# EAGLE design lajta-hfcs (EAGLE 6.4)

## Sheet 1 of 3
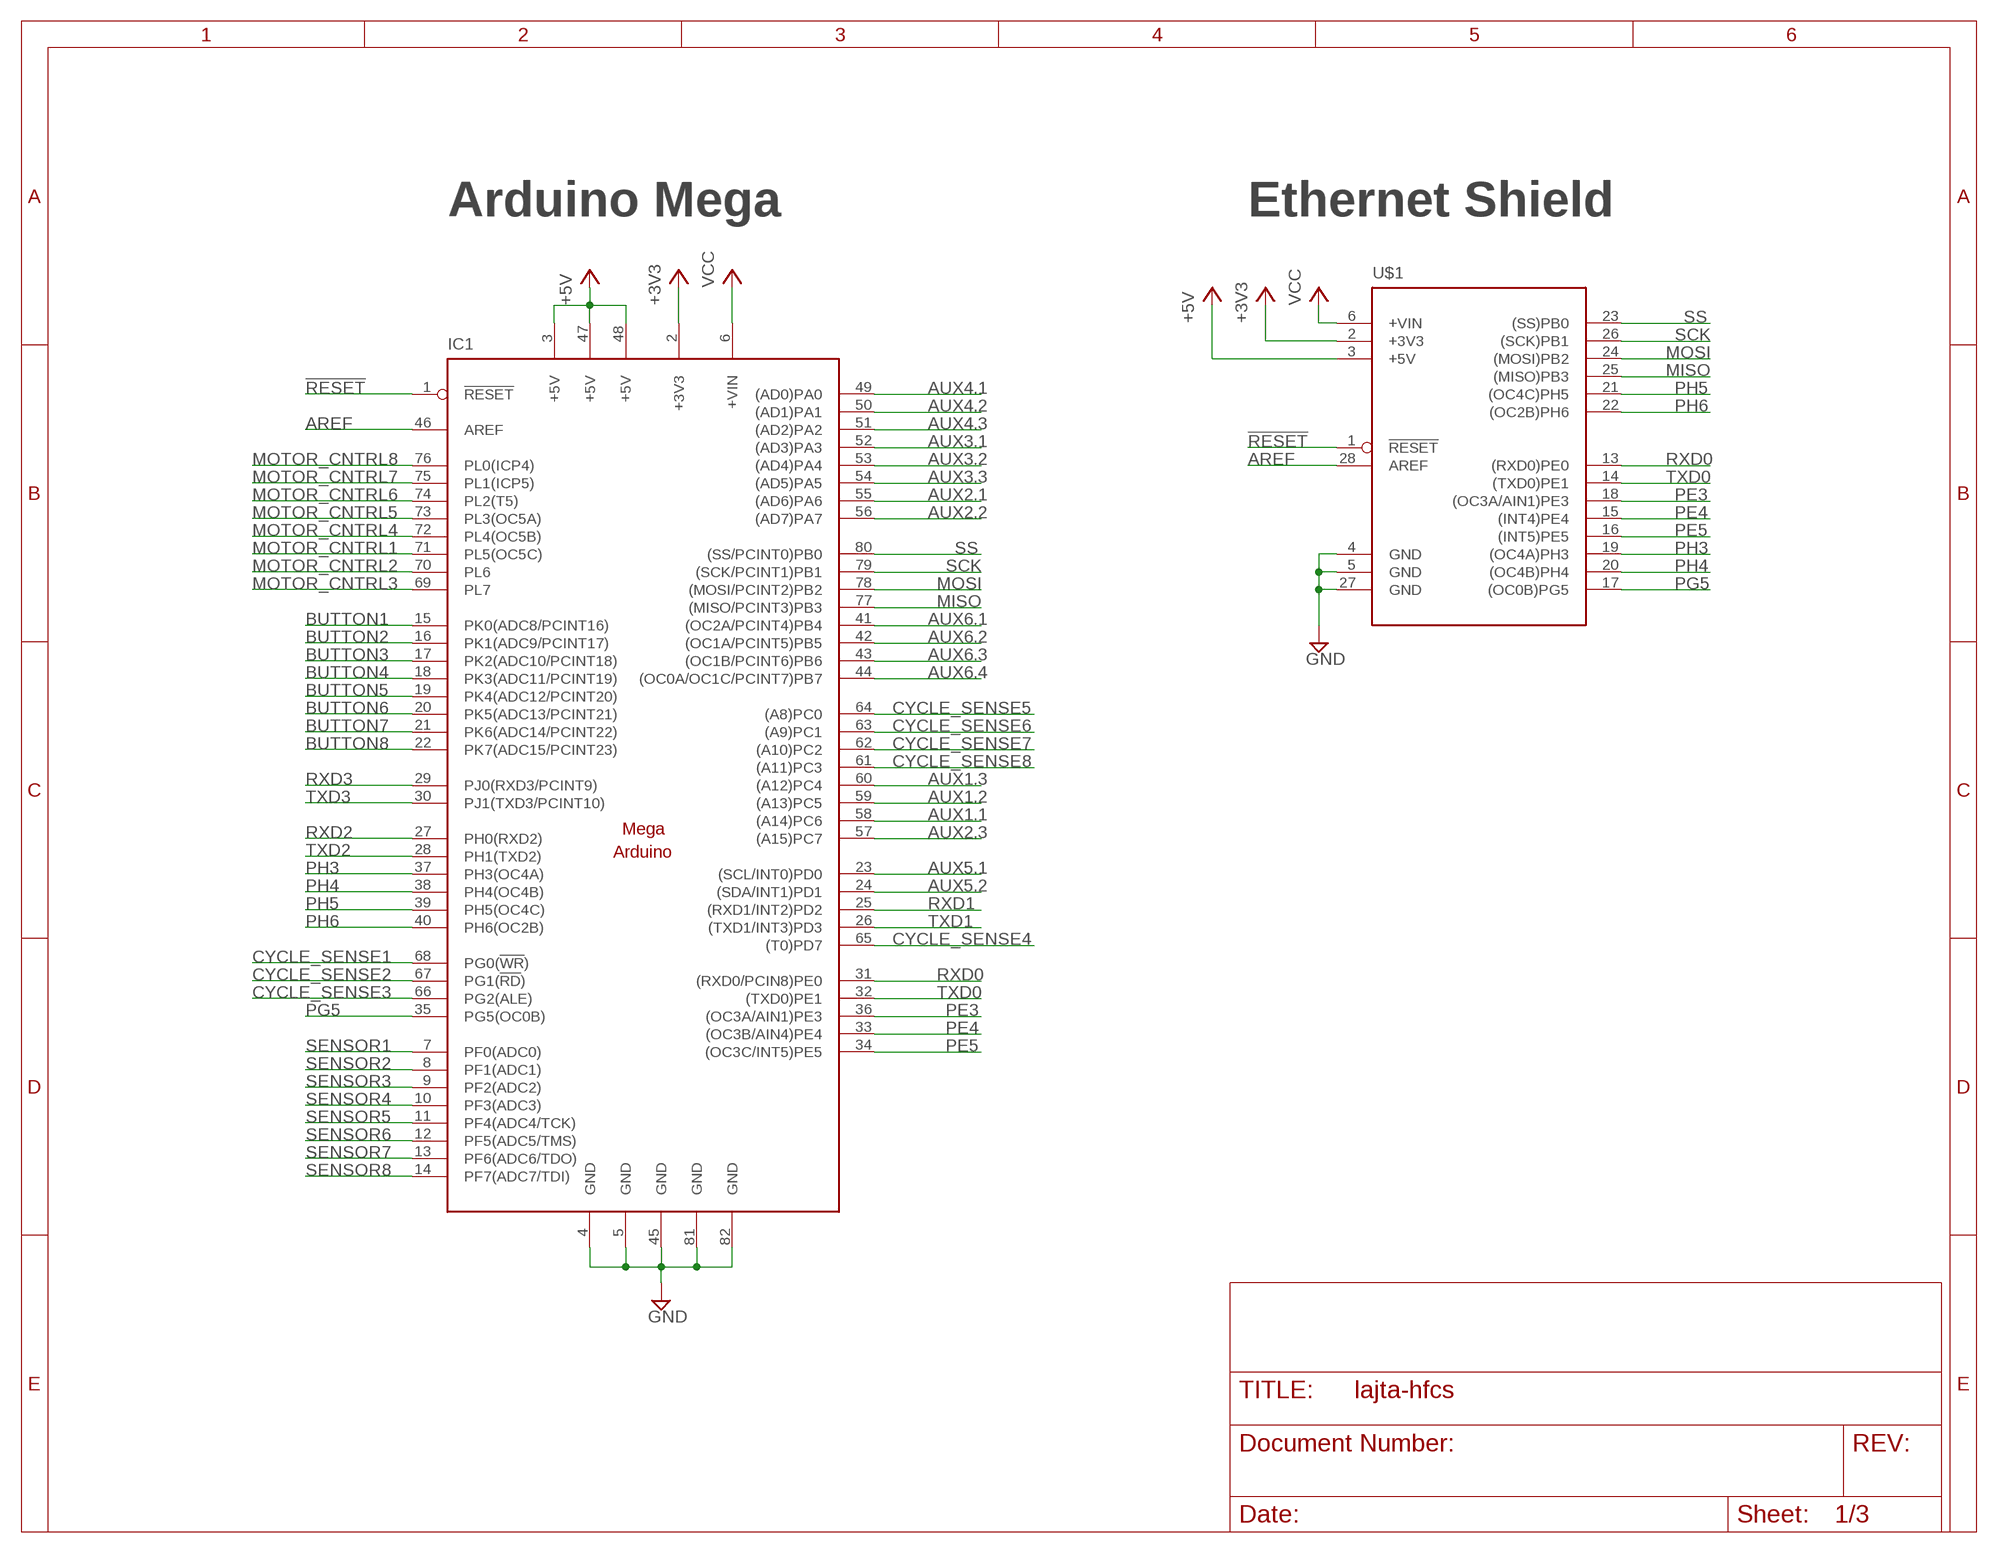
[diagram p0: schematic, sheet 1]

### Parts
IC1  MEGAARDUINO_1  [MEGA_ARDUINO]
U$1  MEGAARDUINO_ETHERNET_SHIELD  [ETHERNET_SHIELD]

### Nets
!RESET: IC1.1(!RESET) U$1.1(!RESET)
+3V3: IC1.2(+3V3) U$1.2(+3V3)
+5V: IC1.3(+5V) IC1.47(+5V) IC1.48(+5V) U$1.3(+5V) ; also sheet 2,3
AREF: IC1.46(AREF) U$1.28(AREF)
AUX1.1: IC1.58((A14)PC6) ; also sheet 3
AUX1.2: IC1.59((A13)PC5) ; also sheet 3
AUX1.3: IC1.60((A12)PC4) ; also sheet 3
AUX2.1: IC1.55((AD6)PA6) ; also sheet 3
AUX2.2: IC1.56((AD7)PA7) ; also sheet 3
AUX2.3: IC1.57((A15)PC7) ; also sheet 3
AUX3.1: IC1.52((AD3)PA3) ; also sheet 3
AUX3.2: IC1.53((AD4)PA4) ; also sheet 3
AUX3.3: IC1.54((AD5)PA5) ; also sheet 3
AUX4.1: IC1.49((AD0)PA0) ; also sheet 3
AUX4.2: IC1.50((AD1)PA1) ; also sheet 3
AUX4.3: IC1.51((AD2)PA2) ; also sheet 3
AUX5.1: IC1.23((SCL/INT0)PD0) ; also sheet 3
AUX5.2: IC1.24((SDA/INT1)PD1) ; also sheet 3
AUX6.1: IC1.41((OC2A/PCINT4)PB4) ; also sheet 3
AUX6.2: IC1.42((OC1A/PCINT5)PB5) ; also sheet 3
AUX6.3: IC1.43((OC1B/PCINT6)PB6) ; also sheet 3
AUX6.4: IC1.44((OC0A/OC1C/PCINT7)PB7) ; also sheet 3
BUTTON1: IC1.15(PK0(ADC8/PCINT16)) ; also sheet 3
BUTTON2: IC1.16(PK1(ADC9/PCINT17)) ; also sheet 3
BUTTON3: IC1.17(PK2(ADC10/PCINT18)) ; also sheet 3
BUTTON4: IC1.18(PK3(ADC11/PCINT19)) ; also sheet 3
BUTTON5: IC1.19(PK4(ADC12/PCINT20)) ; also sheet 3
BUTTON6: IC1.20(PK5(ADC13/PCINT21)) ; also sheet 3
BUTTON7: IC1.21(PK6(ADC14/PCINT22)) ; also sheet 3
BUTTON8: IC1.22(PK7(ADC15/PCINT23)) ; also sheet 3
CYCLE_SENSE1: IC1.68(PG0(!WR!)) ; also sheet 3
CYCLE_SENSE2: IC1.67(PG1(!RD!)) ; also sheet 3
CYCLE_SENSE3: IC1.66(PG2(ALE)) ; also sheet 3
CYCLE_SENSE4: IC1.65((T0)PD7) ; also sheet 3
CYCLE_SENSE5: IC1.64((A8)PC0) ; also sheet 3
CYCLE_SENSE6: IC1.63((A9)PC1) ; also sheet 3
CYCLE_SENSE7: IC1.62((A10)PC2) ; also sheet 3
CYCLE_SENSE8: IC1.61((A11)PC3) ; also sheet 3
GND: IC1.4(GND) IC1.5(GND) IC1.45(GND) IC1.81(GND) IC1.82(GND) U$1.4(GND) U$1.5(GND) U$1.27(GND) ; also sheet 2,3
MISO: IC1.77((MISO/PCINT3)PB3) U$1.25((MISO)PB3) ; also sheet 3
MOSI: IC1.78((MOSI/PCINT2)PB2) U$1.24((MOSI)PB2) ; also sheet 3
MOTOR_CNTRL1: IC1.71(PL5(OC5C)) ; also sheet 2
MOTOR_CNTRL2: IC1.70(PL6) ; also sheet 2
MOTOR_CNTRL3: IC1.69(PL7) ; also sheet 2
MOTOR_CNTRL4: IC1.72(PL4(OC5B)) ; also sheet 2
MOTOR_CNTRL5: IC1.73(PL3(OC5A)) ; also sheet 2
MOTOR_CNTRL6: IC1.74(PL2(T5)) ; also sheet 2
MOTOR_CNTRL7: IC1.75(PL1(ICP5)) ; also sheet 2
MOTOR_CNTRL8: IC1.76(PL0(ICP4)) ; also sheet 2
PE3: IC1.36((OC3A/AIN1)PE3) U$1.18((OC3A/AIN1)PE3)
PE4: IC1.33((OC3B/AIN4)PE4) U$1.15((INT4)PE4)
PE5: IC1.34((OC3C/INT5)PE5) U$1.16((INT5)PE5)
PG5: IC1.35(PG5(OC0B)) U$1.17((OC0B)PG5)
PH3: IC1.37(PH3(OC4A)) U$1.19((OC4A)PH3)
PH4: IC1.38(PH4(OC4B)) U$1.20((OC4B)PH4)
PH5: IC1.39(PH5(OC4C)) U$1.21((OC4C)PH5)
PH6: IC1.40(PH6(OC2B)) U$1.22((OC2B)PH6)
RXD0: IC1.31((RXD0/PCIN8)PE0) U$1.13((RXD0)PE0)
RXD1: IC1.25((RXD1/INT2)PD2) ; also sheet 3
RXD2: IC1.27(PH0(RXD2)) ; also sheet 3
RXD3: IC1.29(PJ0(RXD3/PCINT9)) ; also sheet 3
SCK: IC1.79((SCK/PCINT1)PB1) U$1.26((SCK)PB1) ; also sheet 3
SENSOR1: IC1.7(PF0(ADC0)) ; also sheet 3
SENSOR2: IC1.8(PF1(ADC1)) ; also sheet 3
SENSOR3: IC1.9(PF2(ADC2)) ; also sheet 3
SENSOR4: IC1.10(PF3(ADC3)) ; also sheet 3
SENSOR5: IC1.11(PF4(ADC4/TCK)) ; also sheet 3
SENSOR6: IC1.12(PF5(ADC5/TMS)) ; also sheet 3
SENSOR7: IC1.13(PF6(ADC6/TDO)) ; also sheet 3
SENSOR8: IC1.14(PF7(ADC7/TDI)) ; also sheet 3
SS: IC1.80((SS/PCINT0)PB0) U$1.23((SS)PB0) ; also sheet 3
TXD0: IC1.32((TXD0)PE1) U$1.14((TXD0)PE1)
TXD1: IC1.26((TXD1/INT3)PD3) ; also sheet 3
TXD2: IC1.28(PH1(TXD2)) ; also sheet 3
TXD3: IC1.30(PJ1(TXD3/PCINT10)) ; also sheet 3
VCC: IC1.6(+VIN) U$1.6(+VIN)

### Notes on the sheet
- Arduino Mega | Ethernet Shield

## Sheet 2 of 3
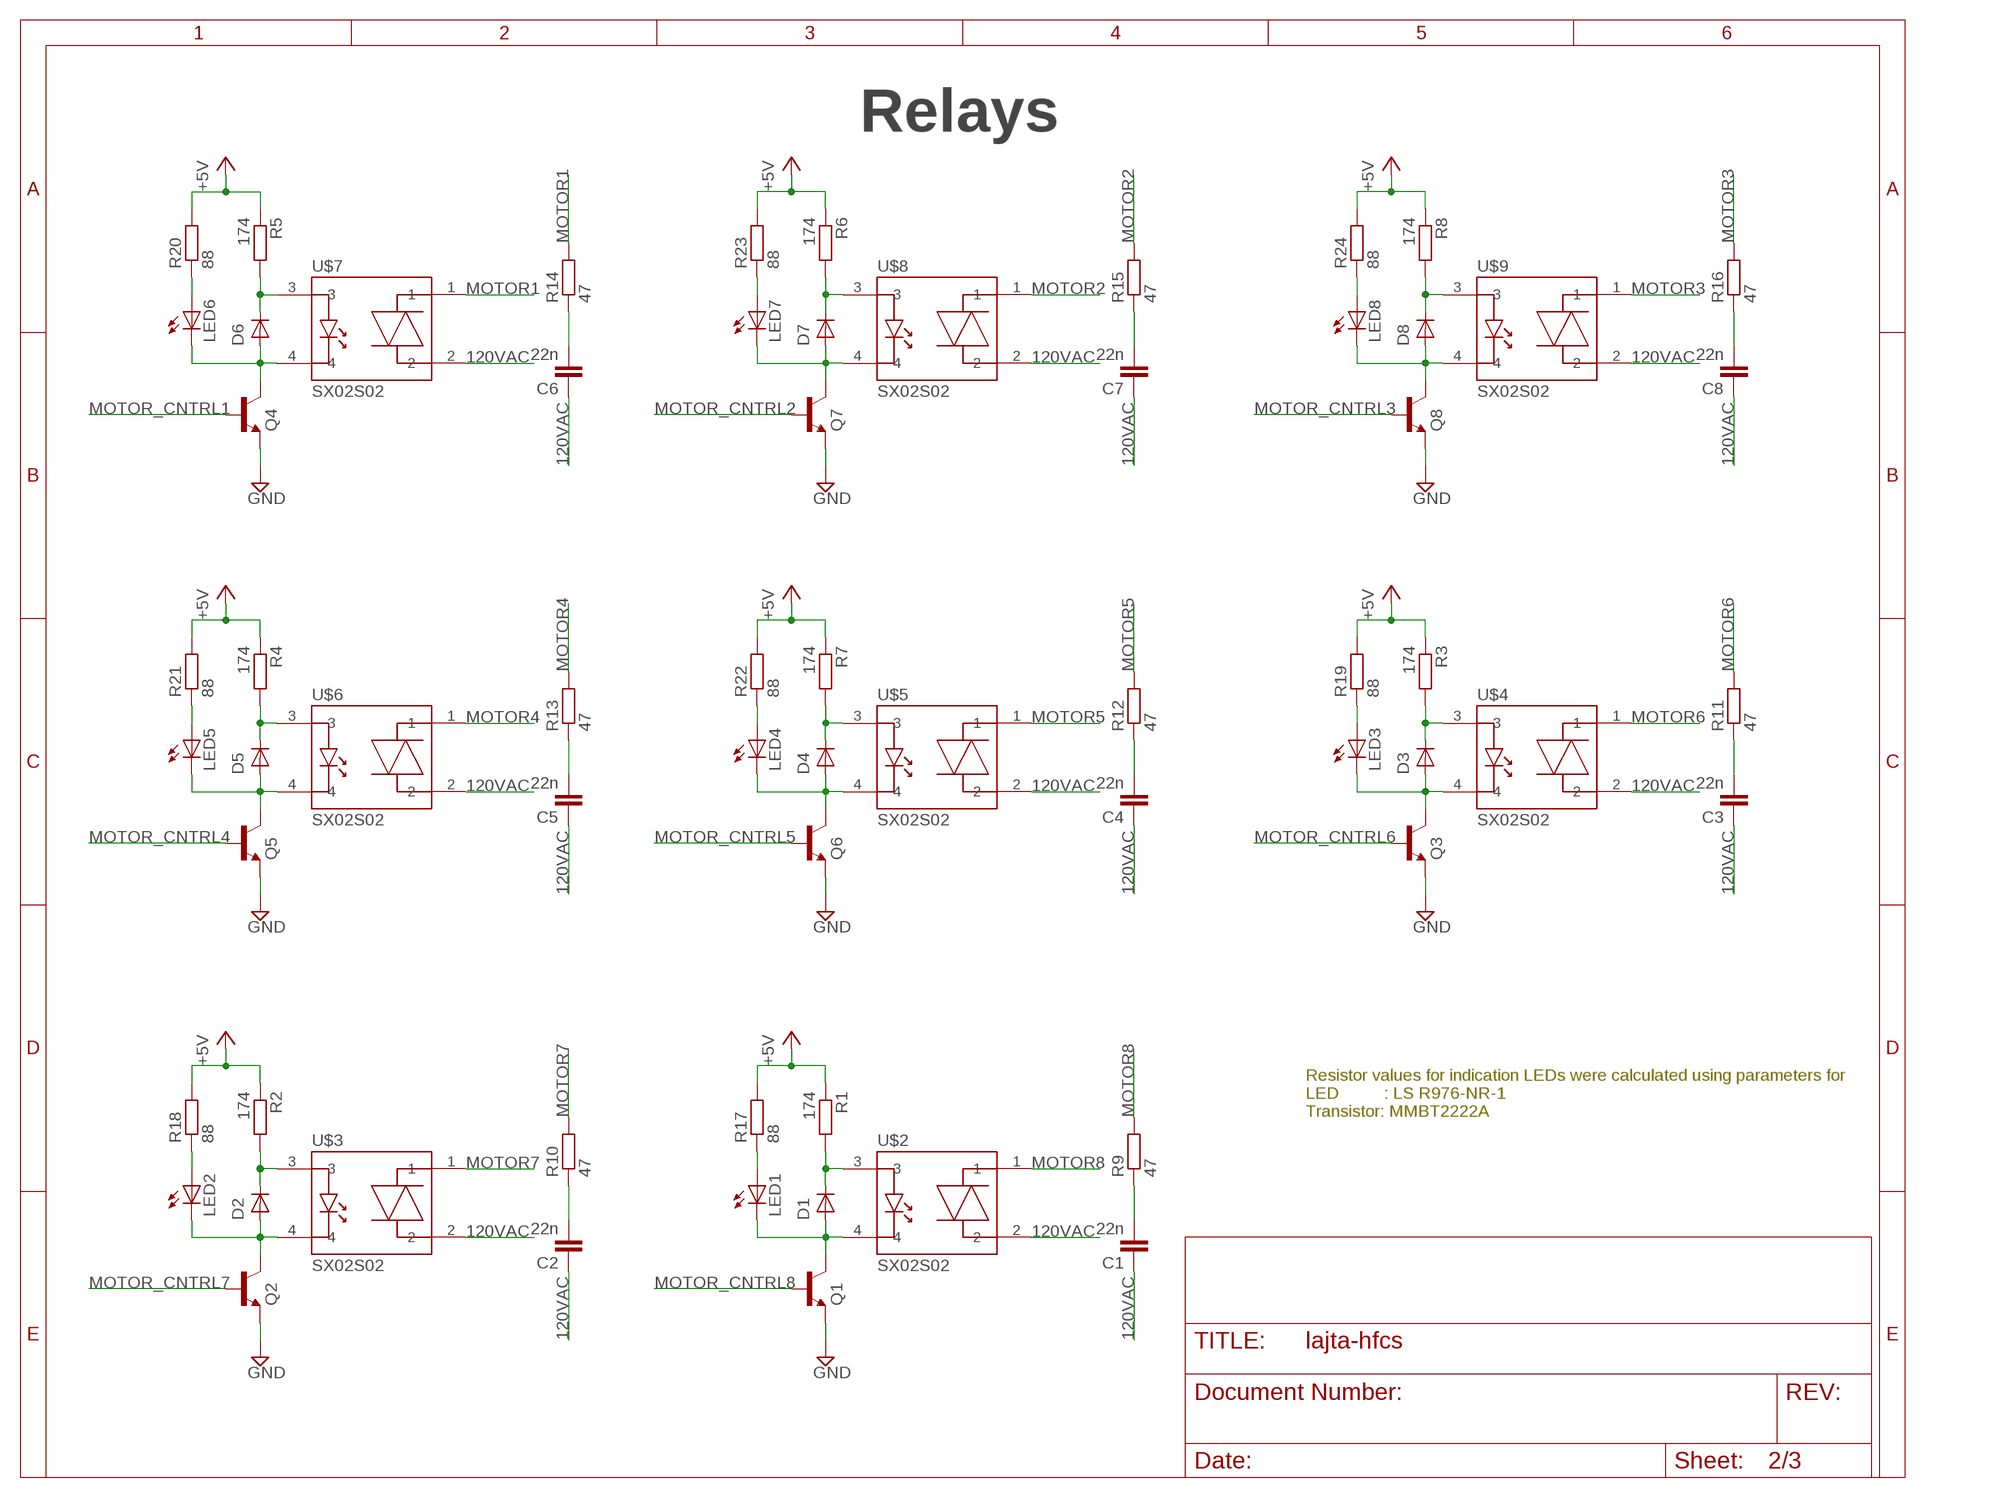
[diagram p1: schematic, sheet 2]

### Parts
C1  22n  C-EUC1812  [C1812]
C2  22n  C-EUC1812  [C1812]
C3  22n  C-EUC1812  [C1812]
C4  22n  C-EUC1812  [C1812]
C5  22n  C-EUC1812  [C1812]
C6  22n  C-EUC1812  [C1812]
C7  22n  C-EUC1812  [C1812]
C8  22n  C-EUC1812  [C1812]
D1  1N4448W  [SOD123]
D2  1N4448W  [SOD123]
D3  1N4448W  [SOD123]
D4  1N4448W  [SOD123]
D5  1N4448W  [SOD123]
D6  1N4448W  [SOD123]
D7  1N4448W  [SOD123]
D8  1N4448W  [SOD123]
LED1  LEDCHIPLED_0805  [CHIPLED_0805]
LED2  LEDCHIPLED_0805  [CHIPLED_0805]
LED3  LEDCHIPLED_0805  [CHIPLED_0805]
LED4  LEDCHIPLED_0805  [CHIPLED_0805]
LED5  LEDCHIPLED_0805  [CHIPLED_0805]
LED6  LEDCHIPLED_0805  [CHIPLED_0805]
LED7  LEDCHIPLED_0805  [CHIPLED_0805]
LED8  LEDCHIPLED_0805  [CHIPLED_0805]
Q1  MMBT2222A  [SOT23]
Q2  MMBT2222A  [SOT23]
Q3  MMBT2222A  [SOT23]
Q4  MMBT2222A  [SOT23]
Q5  MMBT2222A  [SOT23]
Q6  MMBT2222A  [SOT23]
Q7  MMBT2222A  [SOT23]
Q8  MMBT2222A  [SOT23]
R1  174  R-EU_R0805  [R0805]
R2  174  R-EU_R0805  [R0805]
R3  174  R-EU_R0805  [R0805]
R4  174  R-EU_R0805  [R0805]
R5  174  R-EU_R0805  [R0805]
R6  174  R-EU_R0805  [R0805]
R7  174  R-EU_R0805  [R0805]
R8  174  R-EU_R0805  [R0805]
R9  47  R-EU_R0805  [R0805]
R10  47  R-EU_R0805  [R0805]
R11  47  R-EU_R0805  [R0805]
R12  47  R-EU_R0805  [R0805]
R13  47  R-EU_R0805  [R0805]
R14  47  R-EU_R0805  [R0805]
R15  47  R-EU_R0805  [R0805]
R16  47  R-EU_R0805  [R0805]
R17  88  R-EU_R0805  [R0805]
R18  88  R-EU_R0805  [R0805]
R19  88  R-EU_R0805  [R0805]
R20  88  R-EU_R0805  [R0805]
R21  88  R-EU_R0805  [R0805]
R22  88  R-EU_R0805  [R0805]
R23  88  R-EU_R0805  [R0805]
R24  88  R-EU_R0805  [R0805]
U$2  SX02S02  [SIP-4]
U$3  SX02S02  [SIP-4]
U$4  SX02S02  [SIP-4]
U$5  SX02S02  [SIP-4]
U$6  SX02S02  [SIP-4]
U$7  SX02S02  [SIP-4]
U$8  SX02S02  [SIP-4]
U$9  SX02S02  [SIP-4]

### Nets
120VAC: C1.1 C2.1 C3.1 C4.1 C5.1 C6.1 C7.1 C8.1 U$2.2 U$3.2 U$4.2 U$5.2 U$6.2 U$7.2 U$8.2 U$9.2 ; also sheet 3
+5V: R1.1 R2.1 R3.1 R4.1 R5.1 R6.1 R7.1 R8.1 R17.2 R18.2 R19.2 R20.2 R21.2 R22.2 R23.2 R24.2 ; also sheet 1,3
GND: Q1.2(E) Q2.2(E) Q3.2(E) Q4.2(E) Q5.2(E) Q6.2(E) Q7.2(E) Q8.2(E) ; also sheet 1,3
MOTOR1: R14.2 U$7.1 ; also sheet 3
MOTOR2: R15.2 U$8.1 ; also sheet 3
MOTOR3: R16.2 U$9.1 ; also sheet 3
MOTOR4: R13.2 U$6.1 ; also sheet 3
MOTOR5: R12.2 U$5.1 ; also sheet 3
MOTOR6: R11.2 U$4.1 ; also sheet 3
MOTOR7: R10.2 U$3.1 ; also sheet 3
MOTOR8: R9.2 U$2.1 ; also sheet 3
MOTOR_CNTRL1: Q4.1(B) ; also sheet 1
MOTOR_CNTRL2: Q7.1(B) ; also sheet 1
MOTOR_CNTRL3: Q8.1(B) ; also sheet 1
MOTOR_CNTRL4: Q5.1(B) ; also sheet 1
MOTOR_CNTRL5: Q6.1(B) ; also sheet 1
MOTOR_CNTRL6: Q3.1(B) ; also sheet 1
MOTOR_CNTRL7: Q2.1(B) ; also sheet 1
MOTOR_CNTRL8: Q1.1(B) ; also sheet 1
N$1: D1.C R1.2 U$2.3
N$2: D1.A LED1.C Q1.3(C) U$2.4
N$3: LED1.A R17.1
N$4: D2.C R2.2 U$3.3
N$5: D2.A LED2.C Q2.3(C) U$3.4
N$6: LED2.A R18.1
N$7: D3.C R3.2 U$4.3
N$8: D3.A LED3.C Q3.3(C) U$4.4
N$9: LED3.A R19.1
N$10: D4.C R7.2 U$5.3
N$11: D4.A LED4.C Q6.3(C) U$5.4
N$12: LED4.A R22.1
N$13: D5.C R4.2 U$6.3
N$14: D5.A LED5.C Q5.3(C) U$6.4
N$15: LED5.A R21.1
N$16: LED6.A R20.1
N$17: D6.A LED6.C Q4.3(C) U$7.4
N$18: D6.C R5.2 U$7.3
N$19: LED7.A R23.1
N$20: D7.A LED7.C Q7.3(C) U$8.4
N$21: D7.C R6.2 U$8.3
N$22: LED8.A R24.1
N$23: D8.A LED8.C Q8.3(C) U$9.4
N$24: D8.C R8.2 U$9.3
N$33: C8.2 R16.1
N$34: C7.2 R15.1
N$35: C4.2 R12.1
N$36: C5.2 R13.1
N$37: C6.2 R14.1
N$38: C3.2 R11.1
N$39: C2.2 R10.1
N$40: C1.2 R9.1

### Notes on the sheet
- Relays
- Resistor values for indication LEDs were calculated using parameters for
  LED          : LS R976-NR-1
  Transistor: MMBT2222A

## Sheet 3 of 3
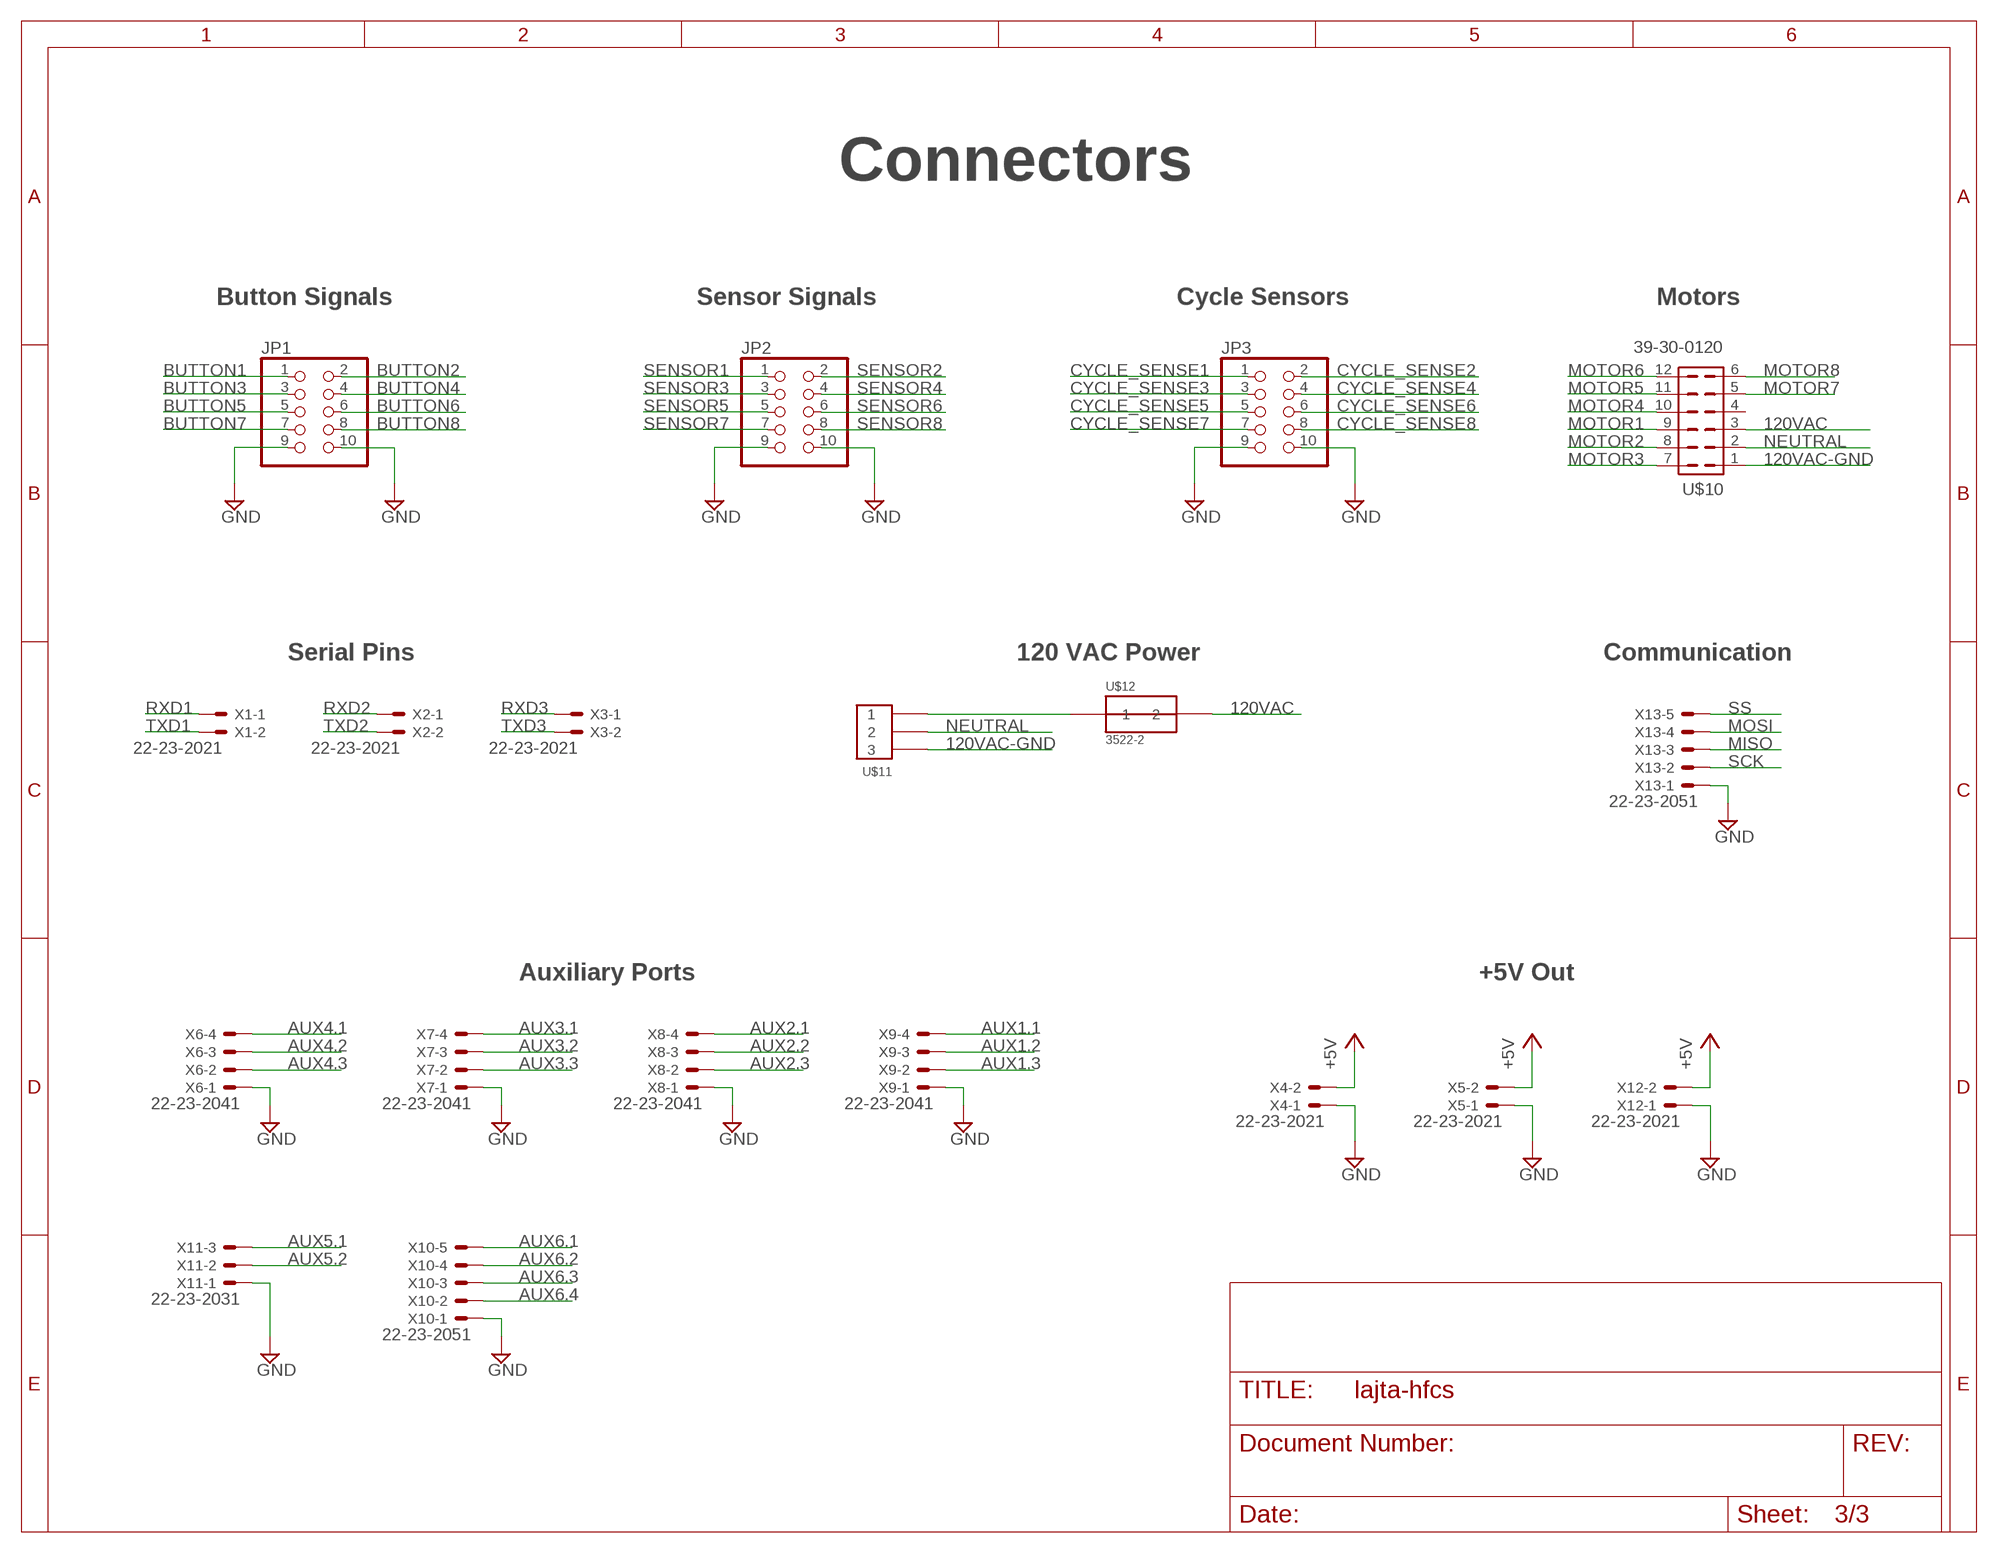
[diagram p2: schematic, sheet 3]

### Parts
JP1  PINHD-2X05_2.00  [2X05M]
JP2  PINHD-2X05_2.00  [2X05M]
JP3  PINHD-2X05_2.00  [2X05M]
U$10  39-30-0120  [MINIFIT5569-2-6]
U$11  39-30-3035  [39-30-3035]
U$12  3522-2  [ATC]
X1  22-23-2021  [22-23-2021]
X2  22-23-2021  [22-23-2021]
X3  22-23-2021  [22-23-2021]
X4  22-23-2021  [22-23-2021]
X5  22-23-2021  [22-23-2021]
X6  22-23-2041  [22-23-2041]
X7  22-23-2041  [22-23-2041]
X8  22-23-2041  [22-23-2041]
X9  22-23-2041  [22-23-2041]
X10  22-23-2051  [22-23-2051]
X11  22-23-2031  [22-23-2031]
X12  22-23-2021  [22-23-2021]
X13  22-23-2051  [22-23-2051]

### Nets
120VAC: U$10.3 U$12.4 ; also sheet 2
120VAC-GND: U$10.1 U$11.3
+5V: X4.2 X5.2 X12.2 ; also sheet 1,2
AUX1.1: X9.4 ; also sheet 1
AUX1.2: X9.3 ; also sheet 1
AUX1.3: X9.2 ; also sheet 1
AUX2.1: X8.4 ; also sheet 1
AUX2.2: X8.3 ; also sheet 1
AUX2.3: X8.2 ; also sheet 1
AUX3.1: X7.4 ; also sheet 1
AUX3.2: X7.3 ; also sheet 1
AUX3.3: X7.2 ; also sheet 1
AUX4.1: X6.4 ; also sheet 1
AUX4.2: X6.3 ; also sheet 1
AUX4.3: X6.2 ; also sheet 1
AUX5.1: X11.3 ; also sheet 1
AUX5.2: X11.2 ; also sheet 1
AUX6.1: X10.5 ; also sheet 1
AUX6.2: X10.4 ; also sheet 1
AUX6.3: X10.3 ; also sheet 1
AUX6.4: X10.2 ; also sheet 1
BUTTON1: JP1.1 ; also sheet 1
BUTTON2: JP1.2 ; also sheet 1
BUTTON3: JP1.3 ; also sheet 1
BUTTON4: JP1.4 ; also sheet 1
BUTTON5: JP1.5 ; also sheet 1
BUTTON6: JP1.6 ; also sheet 1
BUTTON7: JP1.7 ; also sheet 1
BUTTON8: JP1.8 ; also sheet 1
CYCLE_SENSE1: JP3.1 ; also sheet 1
CYCLE_SENSE2: JP3.2 ; also sheet 1
CYCLE_SENSE3: JP3.3 ; also sheet 1
CYCLE_SENSE4: JP3.4 ; also sheet 1
CYCLE_SENSE5: JP3.5 ; also sheet 1
CYCLE_SENSE6: JP3.6 ; also sheet 1
CYCLE_SENSE7: JP3.7 ; also sheet 1
CYCLE_SENSE8: JP3.8 ; also sheet 1
GND: JP1.9 JP1.10 JP2.9 JP2.10 JP3.9 JP3.10 X4.1 X5.1 X6.1 X7.1 X8.1 X9.1 X10.1 X11.1 X12.1 X13.1 ; also sheet 1,2
MISO: X13.3 ; also sheet 1
MOSI: X13.4 ; also sheet 1
MOTOR1: U$10.9 ; also sheet 2
MOTOR2: U$10.8 ; also sheet 2
MOTOR3: U$10.7 ; also sheet 2
MOTOR4: U$10.10 ; also sheet 2
MOTOR5: U$10.11 ; also sheet 2
MOTOR6: U$10.12 ; also sheet 2
MOTOR7: U$10.5 ; also sheet 2
MOTOR8: U$10.6 ; also sheet 2
N$25: U$11.1 U$12.1
NEUTRAL: U$10.2 U$11.2
RXD1: X1.1 ; also sheet 1
RXD2: X2.1 ; also sheet 1
RXD3: X3.1 ; also sheet 1
SCK: X13.2 ; also sheet 1
SENSOR1: JP2.1 ; also sheet 1
SENSOR2: JP2.2 ; also sheet 1
SENSOR3: JP2.3 ; also sheet 1
SENSOR4: JP2.4 ; also sheet 1
SENSOR5: JP2.5 ; also sheet 1
SENSOR6: JP2.6 ; also sheet 1
SENSOR7: JP2.7 ; also sheet 1
SENSOR8: JP2.8 ; also sheet 1
SS: X13.5 ; also sheet 1
TXD1: X1.2 ; also sheet 1
TXD2: X2.2 ; also sheet 1
TXD3: X3.2 ; also sheet 1
Unconnected: U$10.4

### Notes on the sheet
- Connectors
- Button Signals | Sensor Signals | Cycle Sensors | Motors
- Serial Pins | 120 VAC Power | Communication
- Auxiliary Ports | +5V Out

## Library data of the parts
C1-C8 = rcl:C-EU: CAPACITOR, European symbol
D1-D8 = diodes-standard:1N4448W
IC1 = arduino:MEGAARDUINO_1: The Arduino Mega is a microcontroller board based on the ATmega1280. - 54 digital input/output pins (of which 14 can be used as PWM outputs) - 16 analog inputs - 4 UARTs (hardware serial ports) - 16 MHz crystal oscillator - USB connection - power jack - ICSP header - reset button It contains everything needed to support the microcontroller; simply connect it to a computer with a USB cable or power it with a AC-to-DC adapter or battery to get started. The Mega is compatible with most shields designed for the Arduino Duemilanove or Diecimila. http://arduino.cc/en/Main/ArduinoBoardMega
JP1-JP3 = pinhead-2:PINHD-2X05: PIN HEADER
LED1-LED8 = led:LED: LED OSRAM: - CHIPLED LG R971, LG N971, LY N971, LG Q971, LY Q971, LO R971, LY R971 LH N974, LH R974 LS Q976, LO Q976, LY Q976 LO Q996 - Hyper CHIPLED LW Q18S LB Q993, LB Q99A, LB R99A - SideLED LS A670, LO A670, LY A670, LG A670, LP A670 LB A673, LV A673, LT A673, LW A673 LH A674 LY A675 LS A676, LA A676, LO A676, LY A676, LW A676 LS A679, LY A679, LG A679 - Hyper Micro SIDELED® LS Y876, LA Y876, LO Y876, LY Y876 LT Y87S - SmartLED LW L88C, LW L88S LB L89C, LB L89S, LG L890 LS L89K, LO L89K, LY L89K LS L896, LA L896, LO L896, LY L896 - TOPLED LS T670, LO T670, LY T670, LG T670, LP T670 LSG T670, LSP T670, LSY T670, LOP T670, LYG T670 LG T671, LOG T671, LSG T671 LB T673, LV T673, LT T673, LW T673 LH T674 LS T676, LA T676, LO T676, LY T676, LB T676, LH T676, LSB T676, LW T676 LB T67C, LV T67C, LT T67C, LS T67K, LO T67K, LY T67K, LW E67C LS E67B, LA E67B, LO E67B, LY E67B, LB E67C, LV E67C, LT E67C LW T67C LS T679, LY T679, LG T679 LS T770, LO T770, LY T770, LG T770, LP T770 LB T773, LV T773, LT T773, LW T773 LH T774 LS E675, LA E675, LY E675, LS T675 LS T776, LA T776, LO T776, LY T776, LB T776 LHGB T686 LT T68C, LB T68C - Hyper Mini TOPLED® LB M676 - Mini TOPLED Santana® LG M470 LS M47K, LO M47K, LY M47K Source: http://www.osram.convergy.de LUXEON: - LUMILED® LXK2-PW12-R00, LXK2-PW12-S00, LXK2-PW14-U00, LXK2-PW14-V00 LXK2-PM12-R00, LXK2-PM12-S00, LXK2-PM14-U00 LXK2-PE12-Q00, LXK2-PE12-R00, LXK2-PE12-S00, LXK2-PE14-T00, LXK2-PE14-U00 LXK2-PB12-K00, LXK2-PB12-L00, LXK2-PB12-M00, LXK2-PB14-N00, LXK2-PB14-P00, LXK2-PB14-Q00 LXK2-PR12-L00, LXK2-PR12-M00, LXK2-PR14-Q00, LXK2-PR14-R00 LXK2-PD12-Q00, LXK2-PD12-R00, LXK2-PD12-S00 LXK2-PH12-R00, LXK2-PH12-S00 LXK2-PL12-P00, LXK2-PL12-Q00, LXK2-PL12-R00 Source: www.luxeon.com KINGBRIGHT: KA-3528ASYC Source: www.kingbright.com
Q1-Q8 = transistor-bjt:MMBT2222A
R1-R24 = rcl:R-EU_: RESISTOR, European symbol
U$1 = arduino:MEGAARDUINO_ETHERNET_SHIELD
U$2-U$9 = sharp-relays:SX02S02
U$10 = con-molex:39-30-0120
U$11 = con-molex:39-30-3035
U$12 = keystone-fuses:3522-2
X1-X5 X12 = con-molex:22-23-2021: .100" (2.54mm) Center Header - 2 Pin; MF: MOLEX; MPN: 22-23-2021; OC_FARNELL: 1462926; OC_NEWARK: 25C3832
X6-X9 = con-molex:22-23-2041: .100" (2.54mm) Center Header - 4 Pin; MF: MOLEX; MPN: 22-23-2041; OC_FARNELL: 1462920; OC_NEWARK: 38C0355
X10 X13 = con-molex:22-23-2051: .100" (2.54mm) Center Header - 5 Pin; MF: MOLEX; MPN: 22-23-2051; OC_FARNELL: 1462952; OC_NEWARK: 38C9178
X11 = con-molex:22-23-2031: .100" (2.54mm) Center Header - 3 Pin; MF: MOLEX; MPN: 22-23-2031; OC_FARNELL: 1462950; OC_NEWARK: 30C0862

## Board
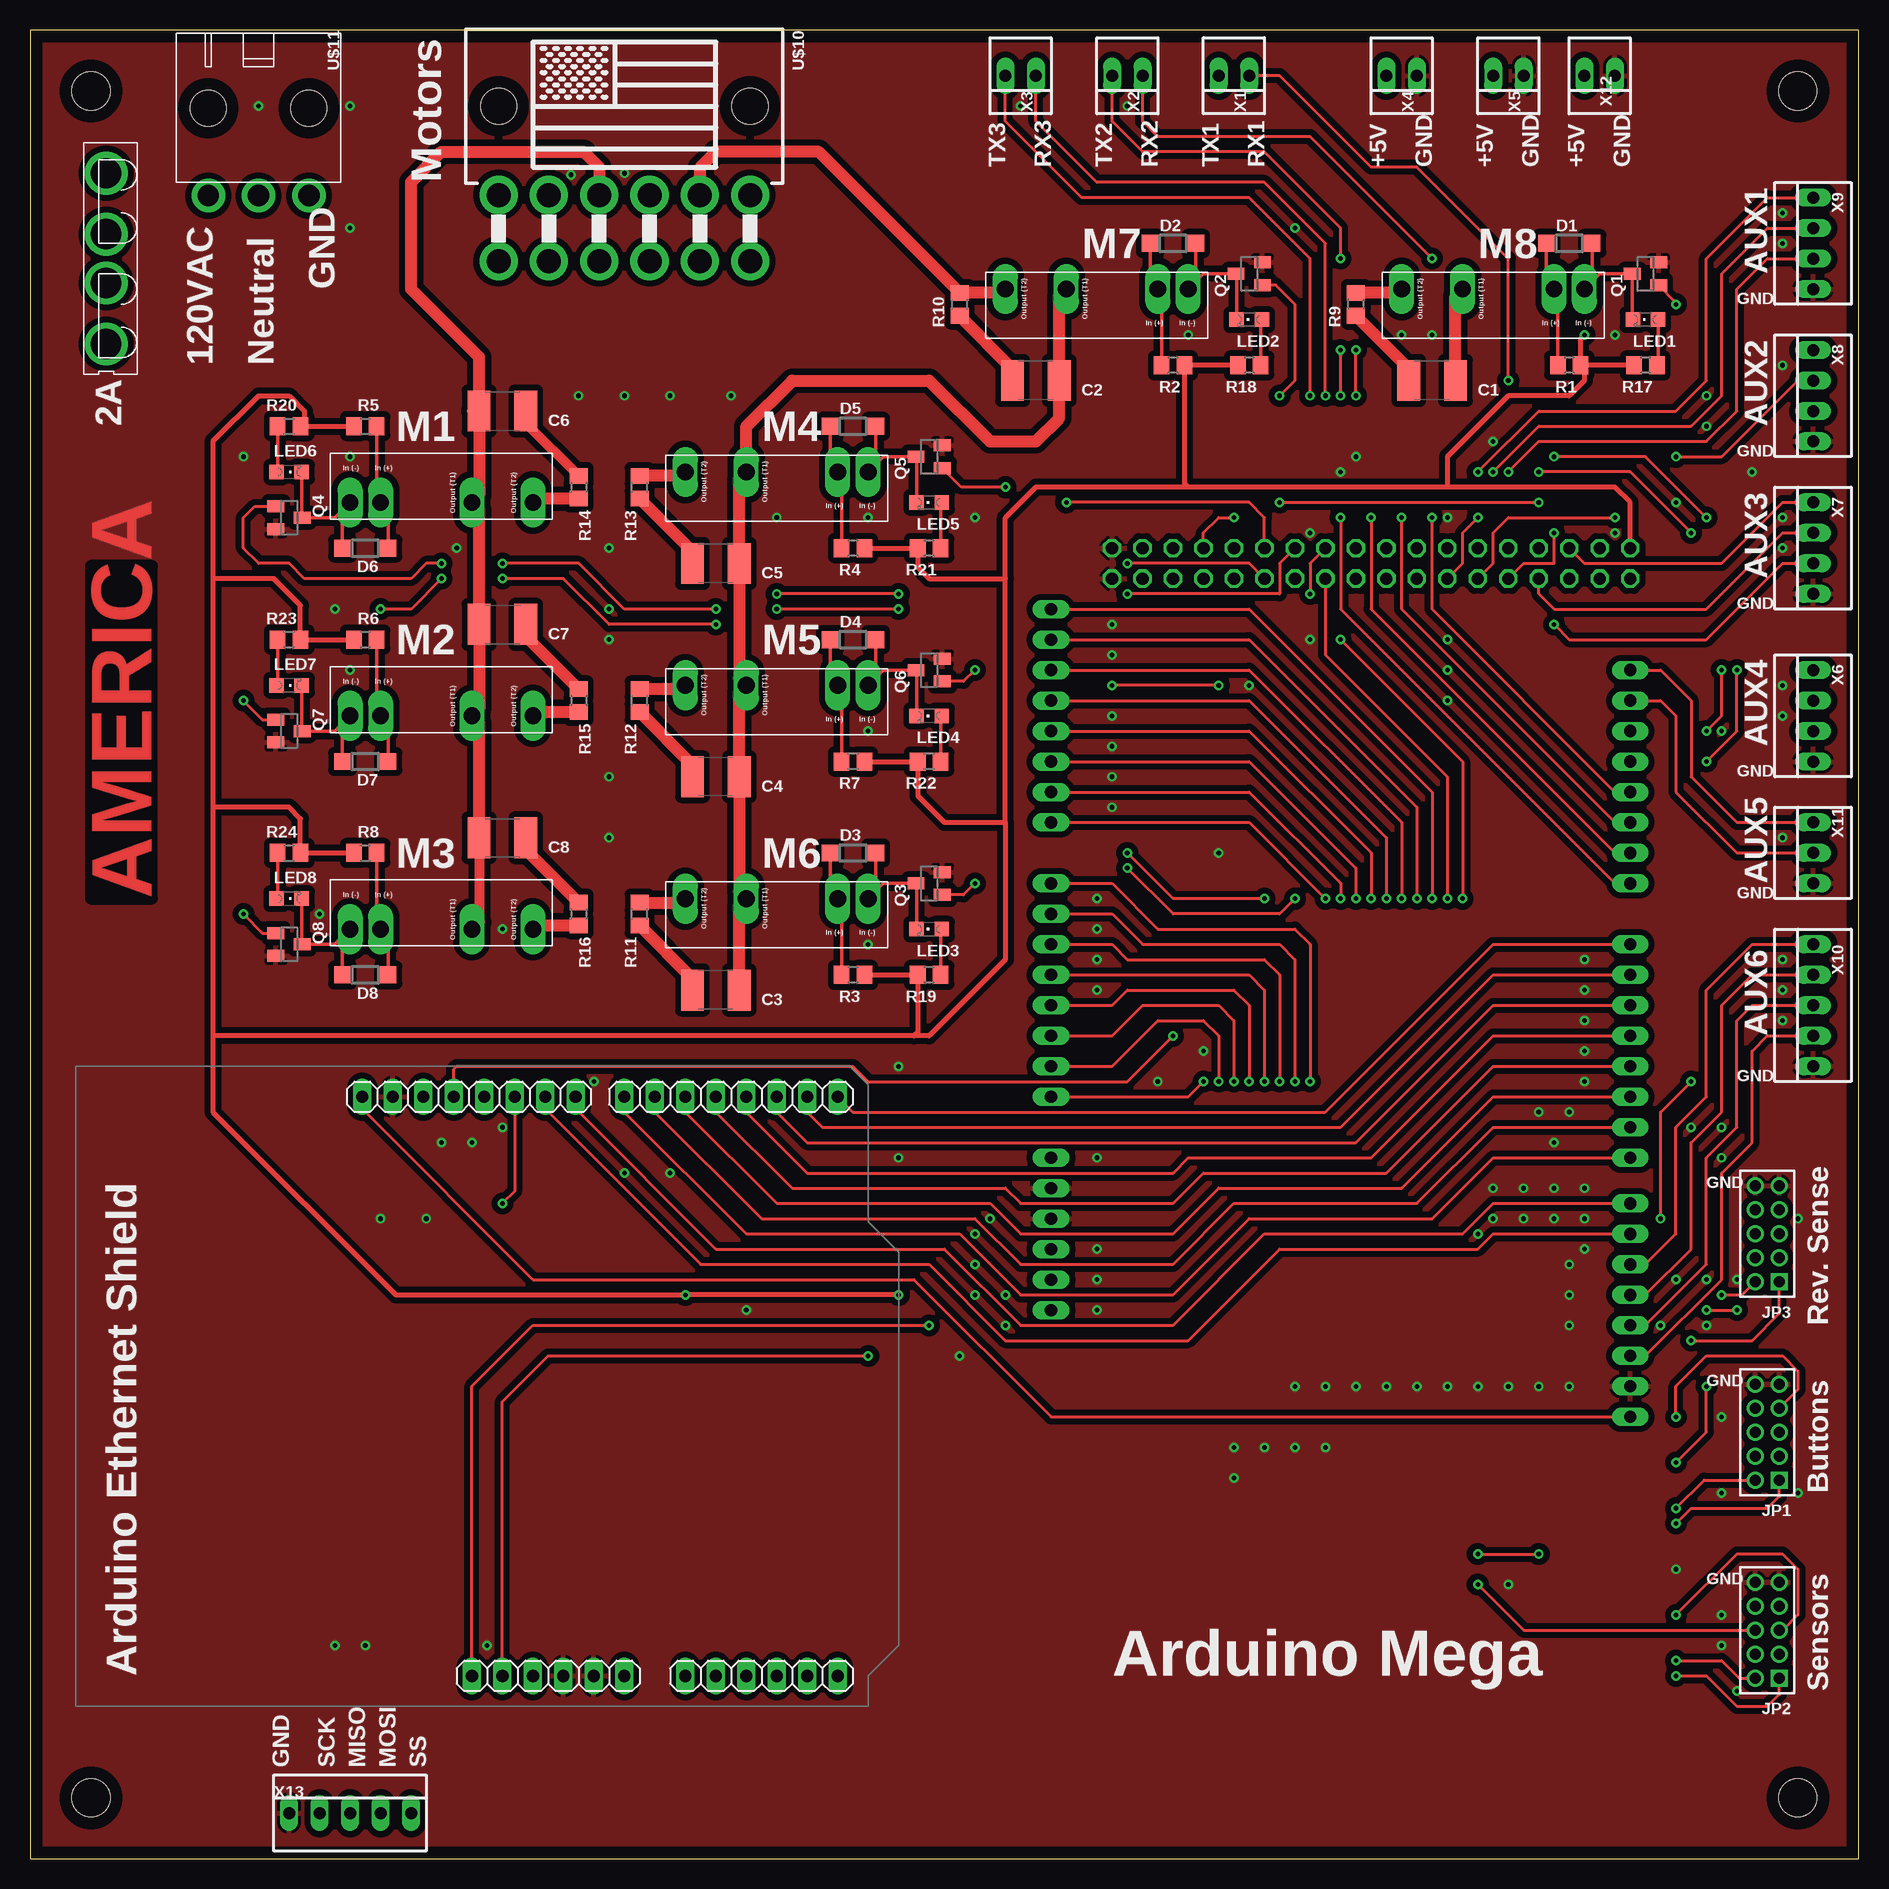
[diagram p3: board, top side]
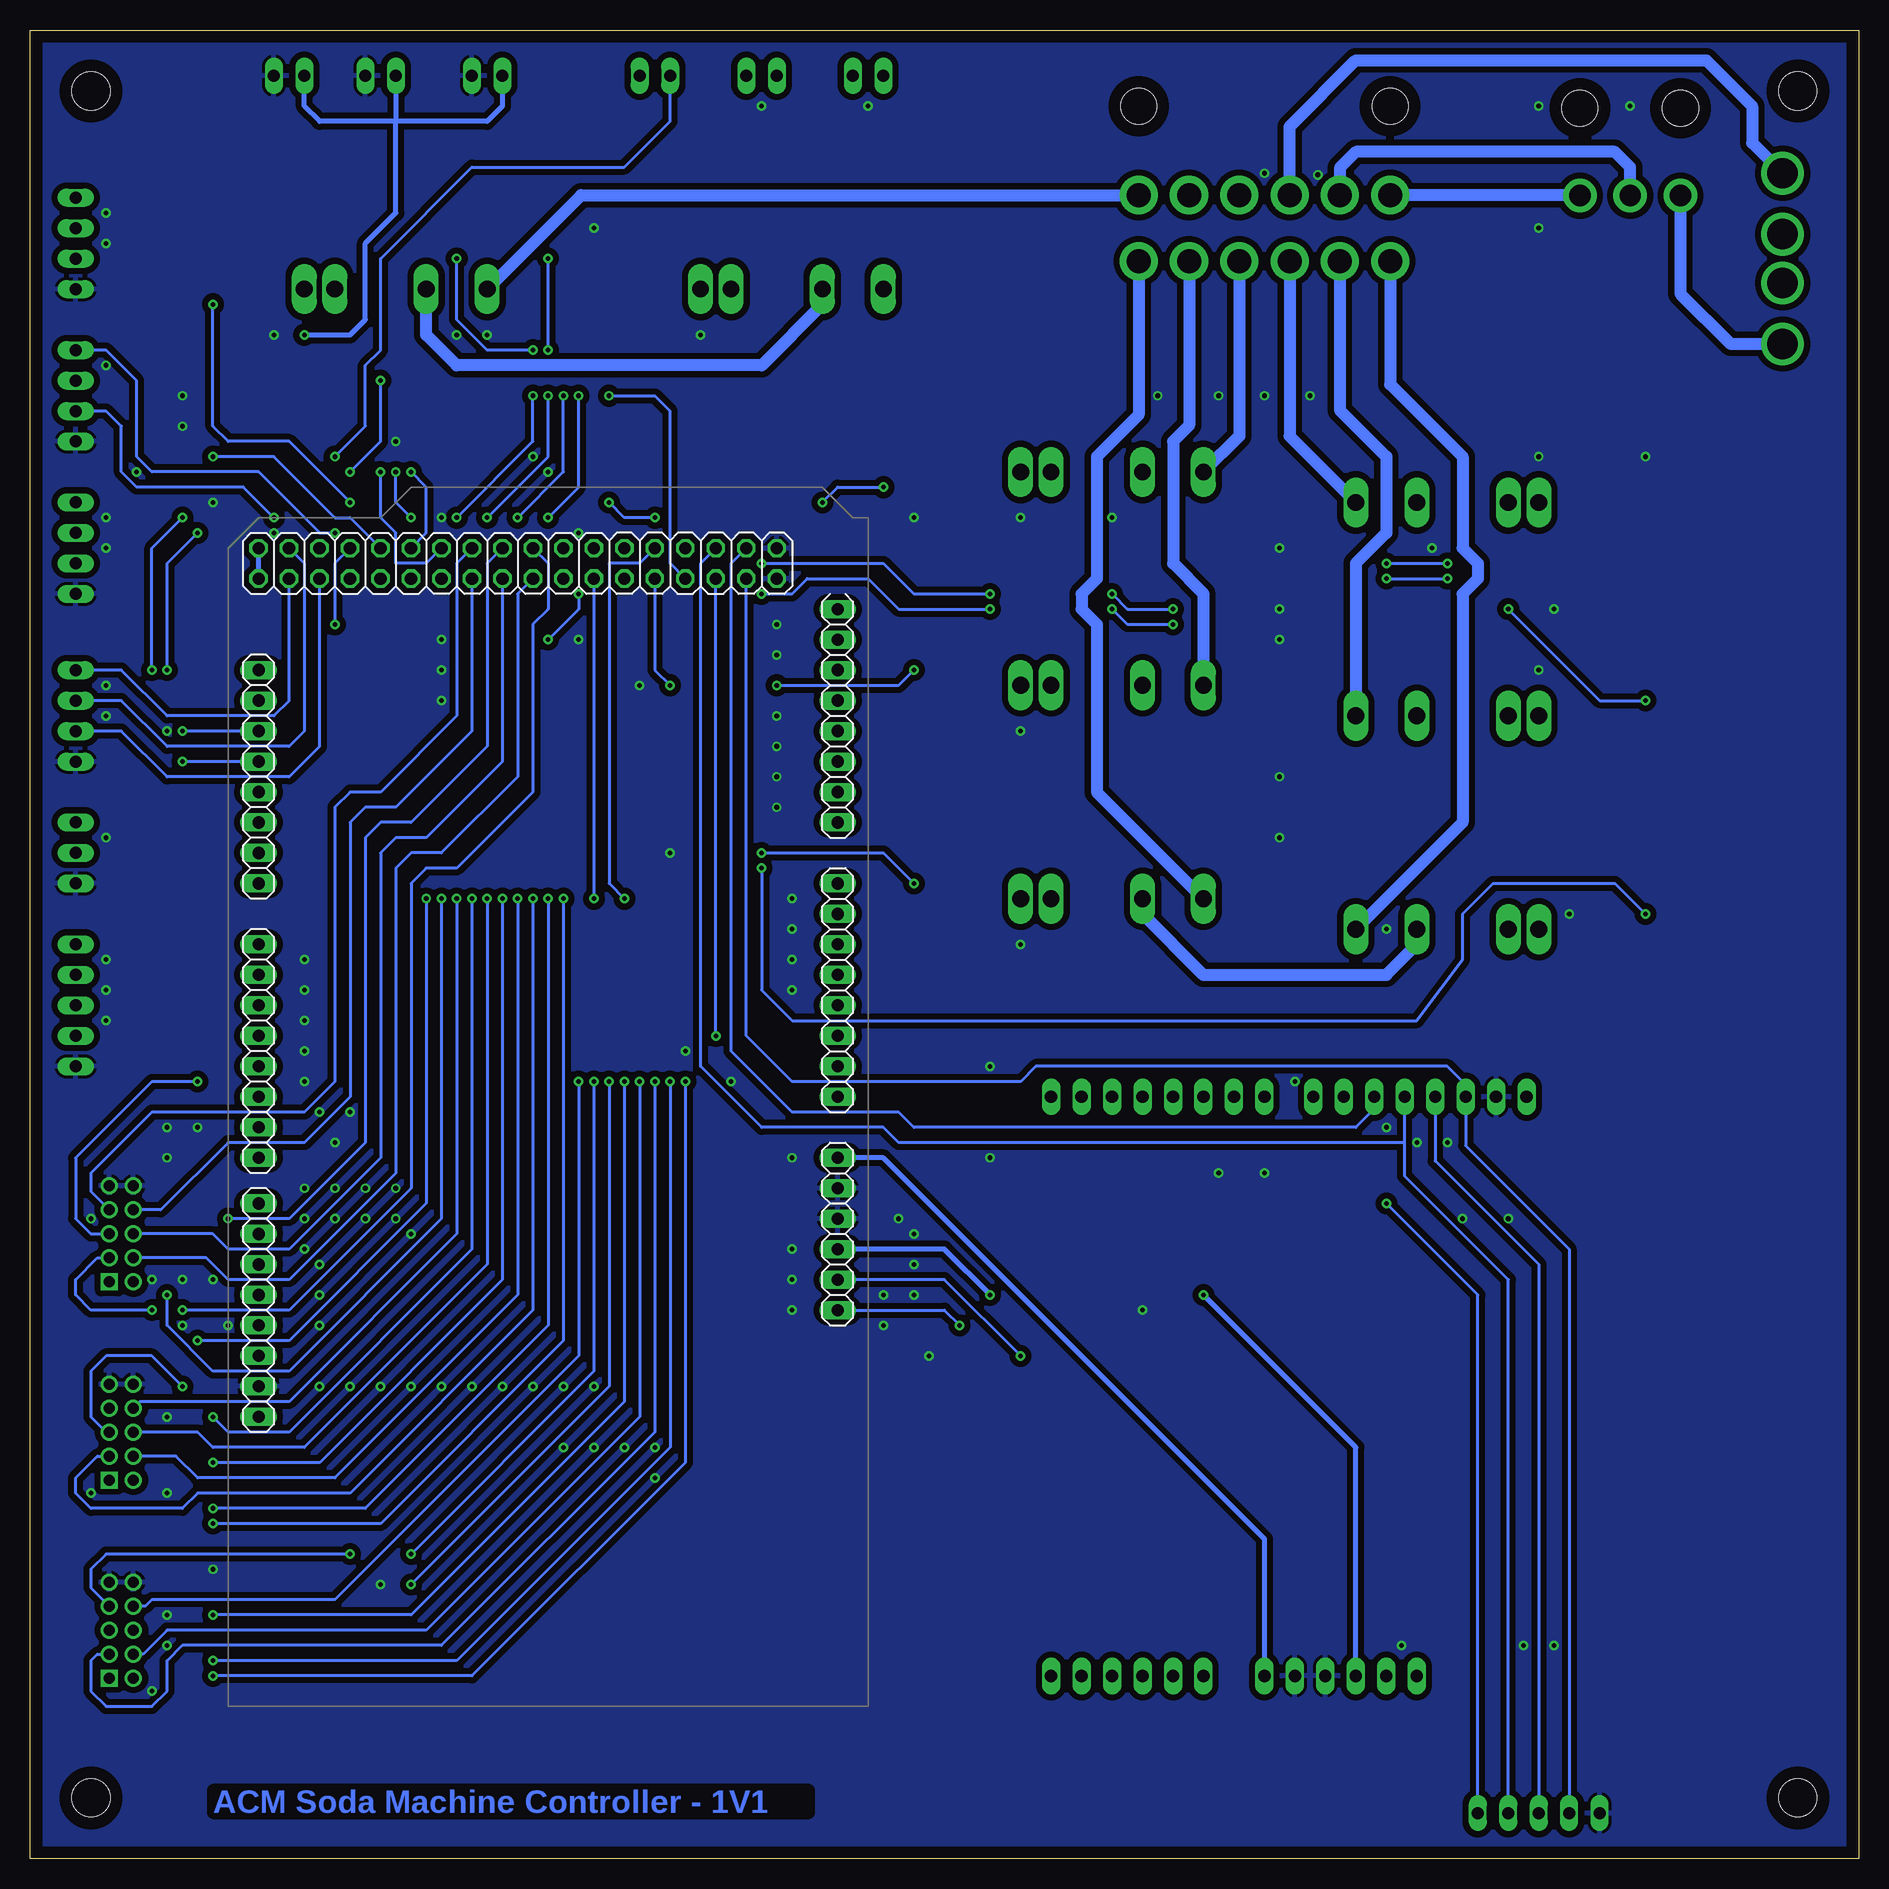
[diagram p4: board, bottom side, seen from below]

Size 152.4 x 152.4 mm. Coordinates in mm from the lower left corner, seen from the top.
Outline: 0,0 152.38,0 152.4,152.4 0,152.4 0,0
Copper layers (1*16): Top 0.035mm / dielectric 1.5mm / Bottom 0.035mm
Design rules "default *": minimum track width 10mil, minimum drill 8mil, track to track 6mil, track to pad 6mil, pad to pad 6mil, via to via 6mil, smd to smd 6mil, copper to edge 40mil, drill to drill 6mil, minimum pad ring 10mil, minimum via ring 8mil, stop-mask expansion 4mil, vias tented up to drill 0mil, thermal gap 10mil
Holes 3.17 mm at 147.32,5.08 5.08,5.08 147.32,147.32 5.08,147.32

### Footprints (pad centres in the part's own frame; a part is rotated, then mirrored left to right if it is on the bottom)
C1812 = smd 1.9 x 3.4: 1 -1.95,0; 2 1.95,0
SOD123 = smd 1.4 x 1.4: A 1.9,0; C -1.9,0
MEGA_ARDUINO = drill 1.016 long: 1 33.02,2.54; 2 35.56,2.54; 3 38.1,2.54; 4 40.64,2.54; 5 43.18,2.54; 6 45.72,2.54; 7 50.8,2.54; 8 53.34,2.54; 9 55.88,2.54; 10 58.42,2.54; 11 60.96,2.54; 12 63.5,2.54; 13 66.04,2.54; 14 68.58,2.54; 15 73.66,2.54; 16 76.2,2.54; 17 78.74,2.54; 18 81.28,2.54; 19 83.82,2.54; 20 86.36,2.54; 21 88.9,2.54; 22 91.44,2.54; 23 86.36,50.8; 24 83.82,50.8; 25 81.28,50.8; 26 78.74,50.8; 27 76.2,50.8; 28 73.66,50.8; 29 71.12,50.8; 30 68.58,50.8; 31 63.5,50.8; 32 60.96,50.8; 33 58.42,50.8; 34 55.88,50.8; 35 53.34,50.8; 36 50.8,50.8; 37 48.26,50.8; 38 45.72,50.8; 39 41.91,50.8; 40 39.37,50.8; 41 36.83,50.8; 42 34.29,50.8; 43 31.75,50.8; 44 29.21,50.8; 45 26.67,50.8; 46 24.13,50.8 | drill 1.016 octagon: 47 93.98,50.8; 48 96.52,50.8; 49 93.98,48.26; 50 96.52,48.26; 51 93.98,45.72; 52 96.52,45.72; 53 93.98,43.18; 54 96.52,43.18; 55 93.98,40.64; 56 96.52,40.64; 57 93.98,38.1; 58 96.52,38.1; 59 93.98,35.56; 60 96.52,35.56; 61 93.98,33.02; 62 96.52,33.02; 63 93.98,30.48; 64 96.52,30.48; 65 93.98,27.94; 66 96.52,27.94; 67 93.98,25.4; 68 96.52,25.4; 69 93.98,22.86; 70 96.52,22.86; 71 93.98,20.32; 72 96.52,20.32; 73 93.98,17.78; 74 96.52,17.78; 75 93.98,15.24; 76 96.52,15.24; 77 93.98,12.7; 78 96.52,12.7; 79 93.98,10.16; 80 96.52,10.16; 81 93.98,7.62; 82 96.52,7.62
2X05M = drill 0.914 square: 1 -4,-1 | drill 0.914: 2 -4,1; 3 -2,-1; 4 -2,1; 5 0,-1; 6 0,1; 7 2,-1; 8 2,1; 9 4,-1; 10 4,1
CHIPLED_0805 = smd 1.2 x 1.2: A 0,-1.05; C 0,1.05
SOT23 = smd 1 x 1.4: 1 -0.95,-1.1; 2 0.95,-1.1; 3 0,1.1
R0805 = smd 1.3 x 1.5: 1 -0.95,0; 2 0.95,0
ETHERNET_SHIELD = drill 1.016 long: 1 -1.27,-24.13; 2 1.27,-24.13; 3 3.81,-24.13; 4 6.35,-24.13; 5 8.89,-24.13; 6 11.43,-24.13; 7 16.51,-24.13; 8 19.05,-24.13; 9 21.59,-24.13; 10 24.13,-24.13; 11 26.67,-24.13; 12 29.21,-24.13; 13 29.21,24.13; 14 26.67,24.13; 15 24.13,24.13; 16 21.59,24.13; 17 19.05,24.13; 18 16.51,24.13; 19 13.97,24.13; 20 11.43,24.13; 21 7.366,24.13; 22 4.826,24.13; 23 2.286,24.13; 24 -0.254,24.13; 25 -2.794,24.13; 26 -5.334,24.13; 27 -7.874,24.13; 28 -10.414,24.13
SIP-4 = drill 1.4 pad 2.032 long: 1 -7.62,0; 2 -2.54,0; 3 5.08,0; 4 7.62,0
MINIFIT5569-2-6 = drill 2 pad 3.175: 1 10.477,-2.756; 2 6.287,-2.756; 3 2.095,-2.756; 4 -2.095,-2.756; 5 -6.287,-2.756; 6 -10.477,-2.756; 7 10.477,2.756; 8 6.287,2.756; 9 2.095,2.756; 10 -2.095,2.756; 11 -6.287,2.756; 12 -10.477,2.756 | hole 3: 10.477,-10.16; -10.477,-10.16
39-30-3035 = drill 1.778 pad 2.794: 1 4.191,7.455; 2 0,7.455; 3 -4.191,7.455 | hole 2.997: 4.191,0.165; -4.191,0.165
ATC = drill 2.54: 1 -7.112,0; 2 -2.032,0; 3 2.032,0; 4 7.112,0
22-23-2021 = drill 1 long: 1 -1.27,0; 2 1.27,0
22-23-2041 = drill 1 long: 1 -3.81,0; 2 -1.27,0; 3 1.27,0; 4 3.81,0
22-23-2051 = drill 1 long: 1 -5.08,0; 2 -2.54,0; 3 0,0; 4 2.54,0; 5 5.08,0
22-23-2031 = drill 1 long: 1 -2.54,0; 2 0,0; 3 2.54,0

### Placement (x,y rotation side)
C1  116.84,123.19 180 top
C2  83.82,123.19 180 top
C3  57.15,72.39 180 top
C4  57.15,90.17 180 top
C5  57.15,107.95 180 top
C6  39.37,120.65 0 top
C7  39.37,102.87 0 top
C8  39.37,85.09 0 top
D1  128.27,134.62 0 top
D2  95.25,134.62 0 top
D3  68.58,83.82 0 top
D4  68.58,101.6 0 top
D5  68.58,119.38 0 top
D6  27.94,109.22 180 top
D7  27.94,91.44 180 top
D8  27.94,73.66 180 top
IC1  82.55,12.7 90 bottom
JP1  144.78,35.56 90 top
JP2  144.78,19.05 90 top
JP3  144.78,52.07 90 top
LED1  134.62,128.27 90 top
LED2  101.6,128.27 90 top
LED3  74.93,77.47 90 top
LED4  74.93,95.25 90 top
LED5  74.93,113.03 90 top
LED6  21.59,115.57 270 top
LED7  21.59,97.79 270 top
LED8  21.59,80.01 270 top
Q1  134.62,132.08 90 top
Q2  101.6,132.08 90 top
Q3  74.93,81.28 90 top
Q4  21.59,111.76 270 top
Q5  74.93,116.84 90 top
Q6  74.93,99.06 90 top
Q7  21.59,93.98 270 top
Q8  21.59,76.2 270 top
R1  128.27,124.46 180 top
R2  95.25,124.46 180 top
R3  68.58,73.66 180 top
R4  68.58,109.22 180 top
R5  27.94,119.38 0 top
R6  27.94,101.6 0 top
R7  68.58,91.44 180 top
R8  27.94,83.82 0 top
R9  110.49,129.54 90 top
R10  77.47,129.54 90 top
R11  50.8,78.74 90 top
R12  50.8,96.52 90 top
R13  50.8,114.3 90 top
R14  45.72,114.3 270 top
R15  45.72,96.52 270 top
R16  45.72,78.74 270 top
R17  134.62,124.46 180 top
R18  101.6,124.46 180 top
R19  74.93,73.66 180 top
R20  21.59,119.38 0 top
R21  74.93,109.22 180 top
R22  74.93,91.44 180 top
R23  21.59,101.6 0 top
R24  21.59,83.82 0 top
U$1  38.1,39.37 0 top
U$2  121.92,130.81 0 top
U$3  88.9,130.81 0 top
U$4  62.23,80.01 0 top
U$5  62.23,97.79 0 top
U$6  62.23,115.57 0 top
U$7  34.29,113.03 180 top
U$8  34.29,95.25 180 top
U$9  34.29,77.47 180 top
U$10  49.53,135.89 180 top
U$11  19.05,146.05 180 top
U$12  6.35,133.35 90 top
X1  100.33,148.59 180 top
X2  91.44,148.59 180 top
X3  82.55,148.59 180 top
X4  114.3,148.59 180 top
X5  123.19,148.59 180 top
X6  148.59,95.25 90 top
X7  148.59,109.22 90 top
X8  148.59,121.92 90 top
X9  148.59,134.62 90 top
X10  148.59,71.12 90 top
X11  148.59,83.82 90 top
X12  130.81,148.59 180 top
X13  26.67,3.81 0 top

### Tracks (layer width: path | path; a pad name or v marks a point on that pad's centre or on a via)
120VAC
  Top 0.813: C8.1 37.42,78.06 | 59.1,79.42 U$4.2 | 36.83,120.65 C6.1
  Top 1.016: C8.1 37.42,94.66 U$8.2 37.42,95.84 C7.1 37.42,112.44 U$7.2 37.42,113.62 C6.1 37.42,125.14 31.75,130.81 31.75,139.7 34.29,142.24 46.16,142.24 47.43,140.97 U$10.3 | 37.42,78.06 U$9.2 | C3.1 59.1,79.42 | U$4.2 59.1,80.6 C4.1 59.1,97.2 U$5.2 59.1,98.38 C5.1 59.1,114.98 U$6.2 59.69,119.38 63.5,123.19 74.93,123.19 80.01,118.11 83.82,118.11 85.77,120.06 C2.1 85.77,130.22 U$3.2 | C1.1 118.79,130.22 U$2.2
  Bottom 1.016: U$9.2 36.83,76.2 39.37,73.66 54.61,73.66 59.69,78.74 U$4.2 | U$3.2 86.36,129.54 91.44,124.46 116.84,124.46 119.38,127 U$2.2 | U$10.3 47.43,144.34 41.91,149.86 12.7,149.86 8.89,146.05 8.89,143 U$12.4
120VAC-GND
  Bottom 1.016: U$11.3 23.29,138.65 U$10.1
!RESET  (via drill 0.38)
  Top 0.254: U$1.1 36.83,39.37 41.91,44.45 v74.93,44.45
  Bottom 0.254: IC1.1 76.2,45.72 v74.93,44.45
+3V3  (via drill 0.38)
  Top 0.254: U$1.2 39.37,38.1 43.18,41.91 v69.85,41.91
  Bottom 0.254: IC1.2 76.2,48.26 v69.85,41.91
+5V  (via drill 0.38)
  Top 0.406: R5.1 R20.2 22.86,119.7 22.86,120.65 21.59,121.92 19.05,121.92 15.24,118.11 15.24,106.68 | R6.1 R23.2 22.54,104.46 20.32,106.68 15.24,106.68 | R8.1 R24.2 22.54,86.68 21.59,87.63 15.24,87.63 | R3.1 R19.2 | R7.1 R22.2 73.98,88.58 76.2,86.36 81.28,86.36 | R4.1 R21.2 73.98,107.63 74.93,106.68 81.28,106.68 | R17.2 R1.1 | R18.2 R2.1 | 81.28,86.36 81.28,106.68 | 81.28,106.68 81.28,111.76 83.82,114.3 96.52,114.3 | 73.66,73.34 R19.2 | 73.66,68.58 74.93,68.58 81.28,74.93 81.28,86.36 | 73.66,68.58 15.24,68.58 | R1.1 129.54,124.14 129.54,123.19 128.27,121.92 123.19,121.92 118.11,116.84 118.11,114.3 | 118.11,114.3 132.08,114.3 133.35,113.03 IC1.48 | 118.11,114.3 96.52,114.3 | R2.1 96.52,124.14 | v72.39,46.99 v54.61,46.99 30.48,46.99 15.24,62.23 15.24,68.58 | R19.2 73.98,68.9 73.66,68.58 | 15.24,106.68 15.24,87.63 | 15.24,87.63 15.24,68.58 | R2.1 96.2,114.62 96.52,114.3 | R1.1 129.22,126.68 v129.54,127
  Bottom 0.406: v72.39,46.99 76.2,50.8 IC1.3 | U$1.3 41.91,34.29 v54.61,46.99 | IC1.47 IC1.48 | v129.54,127 125.73,127 124.46,128.27 124.46,134.62 121.92,137.16 121.92,144.78 | X4.2 113.03,146.05 114.3,144.78 121.92,144.78 | 121.92,144.78 128.27,144.78 129.54,146.05 X12.2 | X5.2 121.92,144.78
AREF
  Top 0.254: U$1.28 27.69,62.48 41.91,48.26 73.66,48.26 85.09,36.83 IC1.46
AUX1.1  (via drill 0.38)
  Top 0.254: v120.65,115.57 125.73,120.65 137.16,120.65 139.7,123.19 139.7,133.35 144.78,138.43 X9.4
  Bottom 0.254: IC1.58 119.38,110.49 119.38,114.3 v120.65,115.57
AUX1.2  (via drill 0.38)
  Top 0.254: IC1.59 119.38,107.95 119.38,110.49 v120.65,111.76 | v121.92,115.57 125.73,119.38 138.43,119.38 140.97,121.92 140.97,132.08 144.78,135.89 X9.3
  Bottom 0.254: v120.65,111.76 121.92,113.03 v121.92,115.57
AUX1.3  (via drill 0.38)
  Top 0.254: v123.19,115.57 125.73,118.11 139.7,118.11 142.24,120.65 142.24,130.81 144.78,133.35 X9.2
  Bottom 0.254: IC1.60 119.38,107.95 121.92,107.95 121.92,110.49 123.19,111.76 v123.19,115.57
AUX2.1  (via drill 0.38)
  Top 0.254: v127,110.49 127,107.95 124.46,107.95 IC1.55
  Bottom 0.254: v127,110.49 128.27,110.49 133.35,115.57 142.24,115.57 143.51,116.84 143.51,123.19 146.05,125.73 X8.4
AUX2.2  (via drill 0.38)
  Top 0.254: v137.16,116.84 140.97,116.84 147.32,123.19 X8.3
  Bottom 0.254: v137.16,116.84 132.08,116.84 127,111.76 125.73,111.76 IC1.56
AUX2.3  (via drill 0.38)
  Top 0.254: v132.08,111.76 123.19,111.76 121.92,110.49 121.92,107.95 IC1.57
  Bottom 0.254: v132.08,111.76 134.62,114.3 143.51,114.3 144.78,115.57 144.78,119.38 146.05,120.65 X8.2
AUX3.1
  Top 0.254: X7.4 146.05,113.03 140.97,107.95 129.54,107.95 IC1.52
AUX3.2
  Top 0.254: X7.3 146.05,110.49 139.7,104.14 127,104.14 125.73,105.41 IC1.53
AUX3.3  (via drill 0.38)
  Top 0.254: v127,102.87 128.27,101.6 139.7,101.6 146.05,107.95 X7.2
  Bottom 0.254: v127,102.87 127,107.95 IC1.54
AUX4.1
  Bottom 0.254: X6.4 144.78,99.06 140.97,95.25 132.08,95.25 130.81,96.52 IC1.49
AUX4.2
  Bottom 0.254: X6.3 144.78,96.52 140.97,92.71 130.81,92.71 129.54,93.98 129.54,107.95 IC1.50
AUX4.3
  Bottom 0.254: X6.2 144.78,93.98 140.97,90.17 130.81,90.17 128.27,92.71 IC1.51
AUX5.1
  Top 0.254: IC1.23 135.89,99.06 138.43,96.52 138.43,90.17 142.24,86.36 X11.3
AUX5.2
  Top 0.254: IC1.24 135.89,96.52 137.16,95.25 137.16,88.9 142.24,83.82 X11.2
AUX6.1
  Top 0.254: IC1.41 134.62,49.53 137.16,52.07 137.16,60.96 139.7,63.5 139.7,72.39 143.51,76.2 X10.5
AUX6.2
  Top 0.254: IC1.42 134.62,46.99 138.43,50.8 138.43,59.69 140.97,62.23 140.97,71.12 143.51,73.66 X10.4
AUX6.3
  Top 0.254: IC1.43 134.62,44.45 139.7,49.53 139.7,58.42 142.24,60.96 142.24,69.85 143.51,71.12 X10.3
AUX6.4
  Top 0.254: IC1.44 134.62,41.91 140.97,48.26 140.97,57.15 143.51,59.69 143.51,67.31 144.78,68.58 X10.2
BUTTON1  (via drill 0.38)
  Top 0.254: IC1.15 101.6,86.36 v107.95,80.01 | v137.16,27.94 138.43,29.21 144.78,29.21 145.78,30.21 JP1.1
  Bottom 0.254: v107.95,80.01 107.95,43.18 123.19,27.94 v137.16,27.94
BUTTON2  (via drill 0.38)
  Top 0.254: IC1.16 101.6,88.9 109.22,81.28 v109.22,80.01 | v137.16,29.21 139.51,31.56 JP1.2
  Bottom 0.254: v109.22,80.01 109.22,44.45 124.46,29.21 v137.16,29.21
BUTTON3  (via drill 0.38)
  Top 0.254: IC1.17 101.6,91.44 110.49,82.55 v110.49,80.01
  Bottom 0.254: v110.49,80.01 110.49,45.72 125.73,30.48 138.43,30.48 139.7,29.21 147.32,29.21 148.59,30.48 148.59,31.75 146.78,33.56 JP1.3
BUTTON4  (via drill 0.38)
  Top 0.254: IC1.18 101.6,93.98 111.76,83.82 v111.76,80.01
  Bottom 0.254: v111.76,80.01 111.76,46.99 127,31.75 138.43,31.75 140.24,33.56 JP1.4
BUTTON5  (via drill 0.38)
  Top 0.254: IC1.19 101.6,96.52 113.03,85.09 v113.03,80.01 | v137.16,33.02 139.7,35.56 v139.7,39.37
  Bottom 0.254: v113.03,80.01 113.03,48.26 128.27,33.02 v137.16,33.02 | v139.7,39.37 142.24,41.91 146.05,41.91 147.32,40.64 147.32,36.83 146.05,35.56 JP1.5
BUTTON6  (via drill 0.38)
  Top 0.254: IC1.20 101.6,99.06 114.3,86.36 v114.3,80.01
  Bottom 0.254: v114.3,80.01 114.3,49.53 129.54,34.29 137.16,34.29 138.43,35.56 JP1.6
BUTTON7  (via drill 0.38)
  Top 0.254: IC1.21 101.6,101.6 115.57,87.63 v115.57,80.01 | v137.16,36.83 137.16,39.37 139.7,41.91 146.05,41.91 147.32,40.64 147.32,39.1 JP1.7
  Bottom 0.254: v115.57,80.01 115.57,50.8 130.81,35.56 135.89,35.56 v137.16,36.83
BUTTON8  (via drill 0.38)
  Top 0.254: IC1.22 101.6,104.14 116.84,88.9 v116.84,80.01
  Bottom 0.254: v116.84,80.01 116.84,52.07 130.81,38.1 143.24,38.1 JP1.8
CYCLE_SENSE1  (via drill 0.38)
  Top 0.254: v109.22,101.6 119.38,91.44 v119.38,80.01 | JP3.1 145.78,45.45 143.51,43.18 v138.43,43.18 | IC1.68 106.68,107.95 v106.68,105.41
  Bottom 0.254: v119.38,80.01 119.38,54.61 130.81,43.18 v138.43,43.18 | v106.68,105.41 106.68,104.14 v109.22,101.6
CYCLE_SENSE2  (via drill 0.38)
  Top 0.254: IC1.67 107.95,100.33 118.11,90.17 v118.11,80.01 | v140.97,46.99 142.7,46.99 JP3.2
  Bottom 0.254: v118.11,80.01 118.11,53.34 130.81,40.64 137.16,40.64 140.97,44.45 v140.97,46.99
CYCLE_SENSE3  (via drill 0.38)
  Top 0.254: v139.7,45.72 v142.24,45.72
  Bottom 0.254: v142.24,45.72 147.32,45.72 148.59,46.99 148.59,48.26 146.78,50.07 JP3.3 | IC1.66 109.22,107.95 109.22,104.14 110.49,102.87 110.49,88.9 116.84,82.55 119.38,82.55 120.65,81.28 120.65,55.88 130.81,45.72 v139.7,45.72
CYCLE_SENSE4
  Bottom 0.254: IC1.65 111.76,105.41 111.76,90.17 118.11,83.82 120.65,83.82 121.92,82.55 121.92,57.15 130.81,48.26 135.89,48.26 137.7,50.07 JP3.4
CYCLE_SENSE5  (via drill 0.38)
  Top 0.254: v135.89,53.34 135.89,62.23 v138.43,64.77
  Bottom 0.254: IC1.64 114.3,107.95 114.3,92.71 120.65,86.36 123.19,86.36 124.46,85.09 124.46,59.69 130.81,53.34 v135.89,53.34 | v138.43,64.77 142.24,64.77 148.59,58.42 148.59,53.34 147.32,52.07 JP3.5
CYCLE_SENSE6
  Bottom 0.254: IC1.63 113.03,91.44 119.38,85.09 121.92,85.09 123.19,83.82 123.19,58.42 130.81,50.8 135.89,50.8 137.16,52.07 JP3.6
CYCLE_SENSE7
  Bottom 0.254: IC1.62 116.84,107.95 116.84,95.25 123.19,88.9 125.73,88.9 127,87.63 127,64.77 129.54,62.23 142.24,62.23 147.32,57.15 147.32,55.61 JP3.7
CYCLE_SENSE8
  Bottom 0.254: IC1.61 115.57,93.98 121.92,87.63 124.46,87.63 125.73,86.36 125.73,63.5 129.54,59.69 135.89,59.69 141.51,54.07 JP3.8
GND  (via drill 0.38)
  other vias: 96.52,127 69.85,111.76 69.85,93.98 69.85,76.2 24.13,78.74 26.67,99.06 26.67,116.84 17.78,116.84 25.4,104.14 49.53,140.46 38.1,17.78 59.69,45.72 129.54,74.93 129.54,72.39 129.54,69.85 78.74,111.76 90.17,102.87 90.17,100.33 90.17,95.25 90.17,92.71 90.17,90.17 90.17,87.63 77.47,41.91 88.9,45.72 88.9,48.26 88.9,50.8 48.26,90.17 48.26,85.09 48.26,101.6 48.26,109.22 88.9,58.42 45.09,140.34 45.72,121.92 53.34,121.92 58.42,121.92 62.23,111.76 39.37,77.47 53.34,57.15 46.99,64.77 72.39,66.04 72.39,58.42 88.9,80.01 88.9,77.47 88.9,74.93 88.9,72.39 49.53,121.92 19.05,146.05 26.67,146.05 26.67,135.89 129.54,67.31 129.54,64.77 140.97,36.83 123.19,22.86 140.97,20.32 137.16,24.13 99.06,83.82 101.6,97.79 106.68,101.6 118.11,99.06 118.11,101.6 118.11,96.52 97.79,67.31 93.98,64.77 80.01,53.34 78.74,52.07 81.28,44.45 78.74,46.99 81.28,46.99 78.74,49.53 27.94,17.78 25.4,17.78 33.02,53.34 29.21,53.34 36.83,59.69 34.29,59.69 49.53,57.15 39.37,60.96 123.19,39.37 125.73,39.37 128.27,39.37 120.65,39.37 118.11,39.37 115.57,39.37 113.03,39.37 107.95,39.37 110.49,39.37 105.41,39.37 107.95,34.29 105.41,34.29 102.87,34.29 100.33,34.29 100.33,31.75 128.27,44.45 128.27,46.99 128.27,49.53 129.54,50.8 127,53.34 124.46,53.34 121.92,53.34 120.65,52.07 129.54,53.34 127,55.88 124.46,55.88 121.92,55.88 129.54,55.88 127,59.69 125.73,62.23 128.27,62.23 146.05,74.93 146.05,72.39 146.05,69.85 140.97,58.42 140.97,60.96 138.43,60.96 142.24,48.26 139.7,48.26 137.16,48.26 135.89,44.45 139.7,44.45 147.32,53.34 140.97,17.78 142.24,13.97 146.05,85.09 146.05,97.79 146.05,95.25 146.05,109.22 146.05,111.76 146.05,124.46 146.05,134.62 146.05,137.16 105.41,135.89 121.92,118.11 139.7,119.38 139.7,121.92 132.08,127 116.84,127 114.3,127 137.16,113.03 132.08,110.49 118.11,111.76 110.49,116.84 109.22,115.57 91.44,146.05 82.55,146.05 106.68,110.49 143.51,115.57 35.56,109.22 48.26,104.14 140.97,93.98 147.32,30.48 140.97,30.48
  pour Bottom (isolate 0.508): 0,0 152.4,0 152.4,152.4 0,152.4
  pour Top (isolate 0.508): 0,0 152.4,0 152.4,152.4 0,152.4
MISO  (via drill 0.38)
  Top 0.254: U$1.25 35.31,65.79 35.56,66.04 68.58,66.04 69.85,64.77 91.44,64.77 v95.25,68.58
  Bottom 0.254: v95.25,68.58 IC1.77 | U$1.25 35.31,58.17 26.67,49.53 X13.3
MOSI
  Bottom 0.254: IC1.78 96.52,107.95 96.52,66.04 91.44,60.96 81.28,60.96 80.01,59.69 37.85,59.69 | X13.4 29.21,48.26 37.85,56.9 37.85,59.69 | 37.85,59.69 U$1.24
MOTOR1
  Top 1.016: R14.2 42.23,113.35 U$7.1
  Bottom 1.016: U$7.1 47.43,118.56 U$10.9
MOTOR2
  Top 1.016: U$8.1 42.23,95.57 R15.2
  Bottom 1.016: U$8.1 41.91,107.95 39.37,110.49 39.37,116.84 43.24,120.71 U$10.8
MOTOR3
  Top 1.016: U$9.1 42.23,77.79 R16.2
  Bottom 1.016: U$9.1 33.02,86.36 33.02,105.41 31.75,106.68 31.75,107.95 33.02,109.22 33.02,116.84 39.05,122.87 U$10.7
MOTOR4
  Top 1.016: U$6.1 54.29,115.25 R13.2
  Bottom 1.016: U$10.10 51.63,118.56 U$6.1
MOTOR5
  Top 1.016: U$5.1 54.29,97.47 R12.2
  Bottom 1.016: U$10.11 55.82,119.44 57.15,118.11 57.15,107.95 54.61,105.41 U$5.1
MOTOR6
  Top 1.016: R11.2 54.29,79.69 U$4.1
  Bottom 1.016: U$4.1 63.5,88.9 63.5,102.87 64.77,104.14 64.77,105.41 63.5,106.68 63.5,116.84 60.01,120.33 U$10.12
MOTOR7
  Top 1.016: U$3.1 80.96,130.49 R10.2 65.72,142.24 57.15,142.24 55.82,140.91 U$10.5
MOTOR8
  Top 1.016: U$2.1 113.98,130.49 R9.2
  Bottom 1.016: U$2.1 106.46,138.65 U$10.6
MOTOR_CNTRL1  (via drill 0.38)
  Top 0.254: Q4.1 18.73,112.71 17.78,111.76 17.78,109.22 19.05,107.95 21.59,107.95 22.86,106.68 31.75,106.68 33.02,107.95 v34.29,107.95 | IC1.71 101.6,107.95 v91.44,107.95 | v72.39,105.41 v62.23,105.41 | v57.15,104.14 49.53,104.14 45.72,107.95 v39.37,107.95
  Bottom 0.254: v91.44,107.95 81.28,107.95 78.74,105.41 v72.39,105.41 | v62.23,105.41 60.96,104.14 v57.15,104.14 | v39.37,107.95 v34.29,107.95
MOTOR_CNTRL2  (via drill 0.38)
  Top 0.254: v17.78,96.52 19.37,94.93 Q7.1 | v72.39,104.14 v62.23,104.14 | v57.15,102.87 48.26,102.87 44.45,106.68 v39.37,106.68 | v34.29,106.68 31.75,104.14 v29.21,104.14 | IC1.70 104.14,107.95 104.14,105.41 v91.44,105.41
  Bottom 0.254: v29.21,104.14 21.59,96.52 v17.78,96.52 | v62.23,104.14 60.96,102.87 v57.15,102.87 | v39.37,106.68 v34.29,106.68 | v91.44,105.41 88.9,105.41 87.63,106.68 82.55,106.68 80.01,104.14 v72.39,104.14
MOTOR_CNTRL3  (via drill 0.38)
  Top 0.254: v17.78,78.74 19.37,77.15 Q8.1 | v105.41,80.01 104.14,78.74 95.25,78.74 v91.44,82.55
  Bottom 0.254: v17.78,78.74 20.32,81.28 30.48,81.28 33.02,78.74 33.02,74.93 36.83,69.85 88.9,69.85 91.44,72.39 v91.44,82.55 | IC1.69 v105.41,80.01
MOTOR_CNTRL4  (via drill 0.38)
  Top 0.254: IC1.72 102.87,111.76 101.6,113.03 v86.36,113.03 | v81.28,114.3 77.62,114.3 Q5.1
  Bottom 0.254: v86.36,113.03 85.09,114.3 v81.28,114.3
MOTOR_CNTRL5  (via drill 0.38)
  Top 0.254: v78.74,99.06 77.79,98.11 Q6.1 | v99.06,97.79 v90.17,97.79
  Bottom 0.254: IC1.73 100.33,99.06 v99.06,97.79 | v90.17,97.79 80.01,97.79 v78.74,99.06
MOTOR_CNTRL6  (via drill 0.38)
  Top 0.254: v78.74,81.28 77.79,80.33 Q3.1 | v102.87,80.01 95.25,80.01 v91.44,83.82
  Bottom 0.254: IC1.74 101.6,107.95 104.14,107.95 104.14,81.28 v102.87,80.01 | v91.44,83.82 81.28,83.82 v78.74,81.28
MOTOR_CNTRL7  (via drill 0.38)
  Top 0.254: Q2.1 103.82,131.13 105.41,129.54 105.41,123.19 v104.14,121.92
  Bottom 0.254: IC1.75 99.06,107.95 99.06,120.65 100.33,121.92 v104.14,121.92
MOTOR_CNTRL8  (via drill 0.38)
  Top 0.254: IC1.76 97.79,110.49 99.06,111.76 v100.33,111.76 | v104.14,113.03 v125.73,113.03 | v137.16,129.54 137.16,129.69 Q1.1
  Bottom 0.254: v100.33,111.76 102.87,111.76 v104.14,113.03 | v137.16,129.54 137.16,119.38 135.89,118.11 130.81,118.11 v125.73,113.03
N$1
  Top 0.305: D1.C 126.37,131.44 U$2.3 127.32,130.49 R1.2
N$2
  Top 0.305: LED1.C 133.52,128.32 Q1.3 130.81,132.08 U$2.4 130.17,131.44 D1.A
N$3
  Top 0.305: R17.1 135.67,124.56 LED1.A
N$4
  Top 0.305: D2.C 93.35,131.44 U$3.3 94.3,130.49 R2.2
N$5
  Top 0.305: D2.A 97.15,131.44 U$3.4 97.79,132.08 Q2.3 100.55,132.03 LED2.C
N$6
  Top 0.305: R18.1 102.55,128.17 LED2.A
N$7
  Top 0.305: D3.C 66.68,80.64 U$4.3 67.63,79.69 R3.2
N$8
  Top 0.305: D3.A 70.48,80.64 U$4.4 71.12,81.28 Q3.3 73.88,81.23 LED3.C
N$9
  Top 0.305: R19.1 75.88,77.37 LED3.A
N$10
  Top 0.305: D4.C 66.68,98.42 U$5.3 67.63,97.47 R7.2
N$11
  Top 0.305: D4.A 70.48,98.42 U$5.4 71.12,99.06 Q6.3 73.88,99.01 LED4.C
N$12
  Top 0.305: R22.1 75.88,95.15 LED4.A
N$13
  Top 0.305: D5.C 66.68,116.2 U$6.3 67.63,115.25 R4.2
N$14
  Top 0.305: LED5.C 73.88,116.79 Q5.3 71.12,116.84 U$6.4 70.48,116.2 D5.A
N$15
  Top 0.305: R21.1 75.88,112.93 LED5.A
N$16
  Top 0.305: R20.1 20.64,115.67 LED6.A
N$17
  Top 0.305: D6.A 26.04,112.4 U$7.4 25.4,111.76 Q4.3 22.64,111.81 LED6.C
N$18
  Top 0.305: R5.2 28.89,113.35 U$7.3 29.84,112.4 D6.C
N$19
  Top 0.305: R23.1 20.64,97.89 LED7.A
N$20
  Top 0.305: D7.A 26.04,94.62 U$8.4 25.4,93.98 Q7.3 22.64,94.03 LED7.C
N$21
  Top 0.305: R6.2 28.89,95.57 U$8.3 29.84,94.62 D7.C
N$22
  Top 0.305: R24.1 20.64,80.11 LED8.A
N$23
  Top 0.305: LED8.C 22.64,76.25 Q8.3 25.4,76.2 U$9.4 26.04,76.84 D8.A
N$24
  Top 0.305: R8.2 28.89,77.79 U$9.3 29.84,76.84 D8.C
N$25
  Bottom 1.016: U$11.1 14.86,130.43 10.67,126.24 U$12.1
N$33
  Top 1.016: C8.2 41.32,84.09 R16.1
N$34
  Top 1.016: C7.2 41.32,101.87 R15.1
N$35
  Top 1.016: C4.2 55.2,91.17 R12.1
N$36
  Top 1.016: C5.2 55.2,108.95 R13.1
N$37
  Top 0.813: C6.2 41.32,119.65 R14.1
N$38
  Top 1.016: C3.2 55.2,73.39 R11.1
N$39
  Top 1.016: C2.2 81.87,124.19 R10.1
N$40
  Top 0.813: C1.2 114.89,124.19
  Top 1.016: 114.89,124.19 R9.1
NEUTRAL
  Bottom 1.016: U$10.2 43.24,140.91 41.91,142.24 20.32,142.24 19.05,140.97 U$11.2
PE3
  Top 0.254: U$1.18 54.61,62.23 62.23,54.61 80.01,54.61 82.55,52.07 95.25,52.07 99.06,55.88 114.3,55.88 121.92,63.5 IC1.36
PE4
  Top 0.254: U$1.15 62.23,62.23 64.77,59.69 110.49,59.69 121.92,71.12 IC1.33
PE5
  Top 0.254: U$1.16 59.69,62.23 64.77,57.15 95.25,57.15 96.52,58.42 111.76,58.42 121.92,68.58 IC1.34
PG5
  Top 0.254: U$1.17 57.15,62.23 63.5,55.88 81.28,55.88 82.55,54.61 95.25,54.61 97.79,57.15 113.03,57.15 121.92,66.04 IC1.35
PH3
  Top 0.254: U$1.19 52.07,62.23 60.96,53.34 78.74,53.34 82.55,49.53 95.25,49.53 100.33,54.61 115.57,54.61 121.92,60.96 IC1.37
PH4
  Top 0.254: U$1.20 49.53,62.23 59.69,52.07 77.47,52.07 82.55,46.99 95.25,46.99 101.6,53.34 116.84,53.34 121.92,58.42 IC1.38
PH5
  Top 0.254: U$1.21 45.47,62.48 57.15,50.8 76.2,50.8 82.55,44.45 95.25,44.45 102.87,52.07 119.38,52.07 121.92,54.61 IC1.39
PH6
  Top 0.254: U$1.22 42.93,62.48 55.88,49.53 74.93,49.53 81.28,43.18 96.52,43.18 104.14,50.8 120.65,50.8 121.92,52.07 IC1.40
RXD0
  Top 0.254: U$1.13 68.58,62.23 107.95,62.23 121.92,76.2 IC1.31
RXD1  (via drill 0.38)
  Top 0.254: v139.7,93.98 140.97,95.25 v140.97,99.06 | v138.43,110.49 133.35,115.57 v125.73,115.57 | v123.19,123.19 123.19,133.35 115.57,140.97 111.76,140.97 104.14,148.59 X1.1
  Bottom 0.254: IC1.25 v139.7,93.98 | v140.97,99.06 140.97,107.95 v138.43,110.49 | v125.73,115.57 123.19,118.11 v123.19,123.19
RXD2  (via drill 0.38)
  Top 0.254: IC1.27 132.08,88.9 116.84,104.14 v116.84,111.76 | v110.49,121.92 v110.49,125.73 | v116.84,133.35 106.68,143.51 93.98,143.51 92.71,144.78 X2.1
  Bottom 0.254: v116.84,111.76 110.49,118.11 v110.49,121.92 | v110.49,125.73 114.3,125.73 116.84,128.27 v116.84,133.35
RXD3  (via drill 0.38)
  Top 0.254: v111.76,111.76 111.76,104.14 132.08,83.82 IC1.29 | v107.95,121.92 107.95,134.62 102.87,139.7 88.9,139.7 83.82,144.78 X3.1
  Bottom 0.254: v111.76,111.76 107.95,115.57 v107.95,121.92
SCK
  Bottom 0.254: IC1.79 92.71,68.58 88.9,64.77 69.85,64.77 68.58,66.04 34.29,66.04 32.77,64.52 U$1.26 32.77,59.44 24.13,50.8 X13.2
SENSOR1  (via drill 0.38)
  Top 0.254: IC1.7 96.52,63.5 v97.79,64.77 | JP2.1 145.78,13.7 144.78,12.7 142.24,12.7 139.7,15.24 v137.16,15.24
  Bottom 0.254: v97.79,64.77 97.79,33.02 115.57,15.24 v137.16,15.24
SENSOR2  (via drill 0.38)
  Top 0.254: IC1.8 90.17,66.04 93.98,69.85 97.79,69.85 99.06,68.58 v99.06,64.77 | v137.16,16.51 140.97,16.51 142.43,15.05 JP2.2
  Bottom 0.254: v99.06,64.77 99.06,34.29 116.84,16.51 v137.16,16.51
SENSOR3  (via drill 0.38)
  Top 0.254: IC1.9 90.17,68.58 92.71,71.12 99.06,71.12 100.33,69.85 v100.33,64.77
  Bottom 0.254: v100.33,64.77 100.33,35.56 118.11,17.78 139.7,17.78 140.97,16.51 140.97,13.97 142.24,12.7 146.05,12.7 147.32,13.97 147.32,16.51 146.78,17.05 JP2.3
SENSOR4  (via drill 0.38)
  Top 0.254: IC1.10 90.17,71.12 91.44,72.39 100.33,72.39 101.6,71.12 v101.6,64.77
  Bottom 0.254: v101.6,64.77 101.6,36.83 119.38,19.05 140.97,19.05 142.97,17.05 JP2.4
SENSOR5  (via drill 0.38)
  Top 0.254: IC1.11 101.6,73.66 102.87,72.39 v102.87,64.77 | JP2.5 146.05,19.05 147.32,20.32 147.32,24.13 146.05,25.4 142.24,25.4 v137.16,20.32
  Bottom 0.254: v102.87,64.77 102.87,38.1 120.65,20.32 v137.16,20.32
SENSOR6  (via drill 0.38)
  Top 0.254: IC1.12 90.17,76.2 91.44,74.93 102.87,74.93 104.14,73.66 v104.14,64.77 | v120.65,22.86 124.46,19.05 JP2.6
  Bottom 0.254: v104.14,64.77 104.14,39.37 v120.65,22.86
SENSOR7  (via drill 0.38)
  Top 0.254: IC1.13 90.17,78.74 92.71,76.2 104.14,76.2 105.41,74.93 v105.41,64.77 | v120.65,25.4 v125.73,25.4
  Bottom 0.254: v105.41,64.77 105.41,40.64 v120.65,25.4 | v125.73,25.4 146.05,25.4 147.32,24.13 147.32,22.59 JP2.7
SENSOR8  (via drill 0.38)
  Top 0.254: IC1.14 90.17,81.28 93.98,77.47 105.41,77.47 106.68,76.2 v106.68,64.77
  Bottom 0.254: v106.68,64.77 106.68,41.91 127,21.59 142.24,21.59 142.78,21.05 JP2.8
SS  (via drill 0.38)
  Top 0.254: U$1.23 40.39,55.63 v39.37,54.61
  Bottom 0.254: IC1.80 93.98,107.95 93.98,67.31 88.9,62.23 80.01,62.23 78.74,60.96 41.91,60.96 40.39,62.48 U$1.23 | X13.5 31.75,46.99 v39.37,54.61
TXD0
  Top 0.254: U$1.14 64.77,62.23 66.04,60.96 109.22,60.96 121.92,73.66 IC1.32
TXD1  (via drill 0.38)
  Top 0.254: v139.7,91.44 142.24,93.98 v142.24,99.06 | v139.7,111.76 134.62,116.84 v127,116.84
  Bottom 0.254: IC1.26 v139.7,91.44 | v142.24,99.06 142.24,109.22 v139.7,111.76 | v127,116.84 124.46,119.38 124.46,124.46 123.19,125.73 123.19,133.35 115.57,140.97 102.87,140.97 99.06,144.78 X1.2
TXD2  (via drill 0.38)
  Top 0.254: IC1.28 132.08,86.36 114.3,104.14 v114.3,111.76 | v109.22,121.92 v109.22,125.73 | v109.22,133.35 109.22,135.89 102.87,142.24 92.71,142.24 90.17,144.78 X2.2
  Bottom 0.254: v114.3,111.76 109.22,116.84 v109.22,121.92 | v109.22,125.73 v109.22,133.35
TXD3  (via drill 0.38)
  Top 0.254: v109.22,111.76 109.22,104.14 132.08,81.28 IC1.30 | v106.68,121.92 106.68,133.35 101.6,138.43 87.63,138.43 81.28,144.78 X3.2
  Bottom 0.254: v109.22,111.76 106.68,114.3 v106.68,121.92
VCC
  Bottom 0.406: U$1.6 49.53,26.67 81.28,58.42 IC1.6

### Text on the board
Top: AMERICA
Bottom: ACM Soda Machine Controller - 1V1
tNames: TX3 | RX3 | TX2 | RX2 | TX1 | RX1 | +5V | GND | +5V | GND | +5V | GND | Motors | M7 | M8 | AUX1 | GND | GND | 120VAC | Neutral | 2A | AUX2 | M1 | M4 | GND | AUX3 | GND | M2 | M5 | AUX4 | GND | M3 | M6 | AUX5 | GND | AUX6 | GND | GND | Rev. Sense | GND | Buttons | GND | Arduino Ethernet Shield | Arduino Mega | Sensors | GND | SCK | MISO | MOSI | SS